# EAGLE board OmnibusB (EAGLE 6.6.0), part 1 of 2
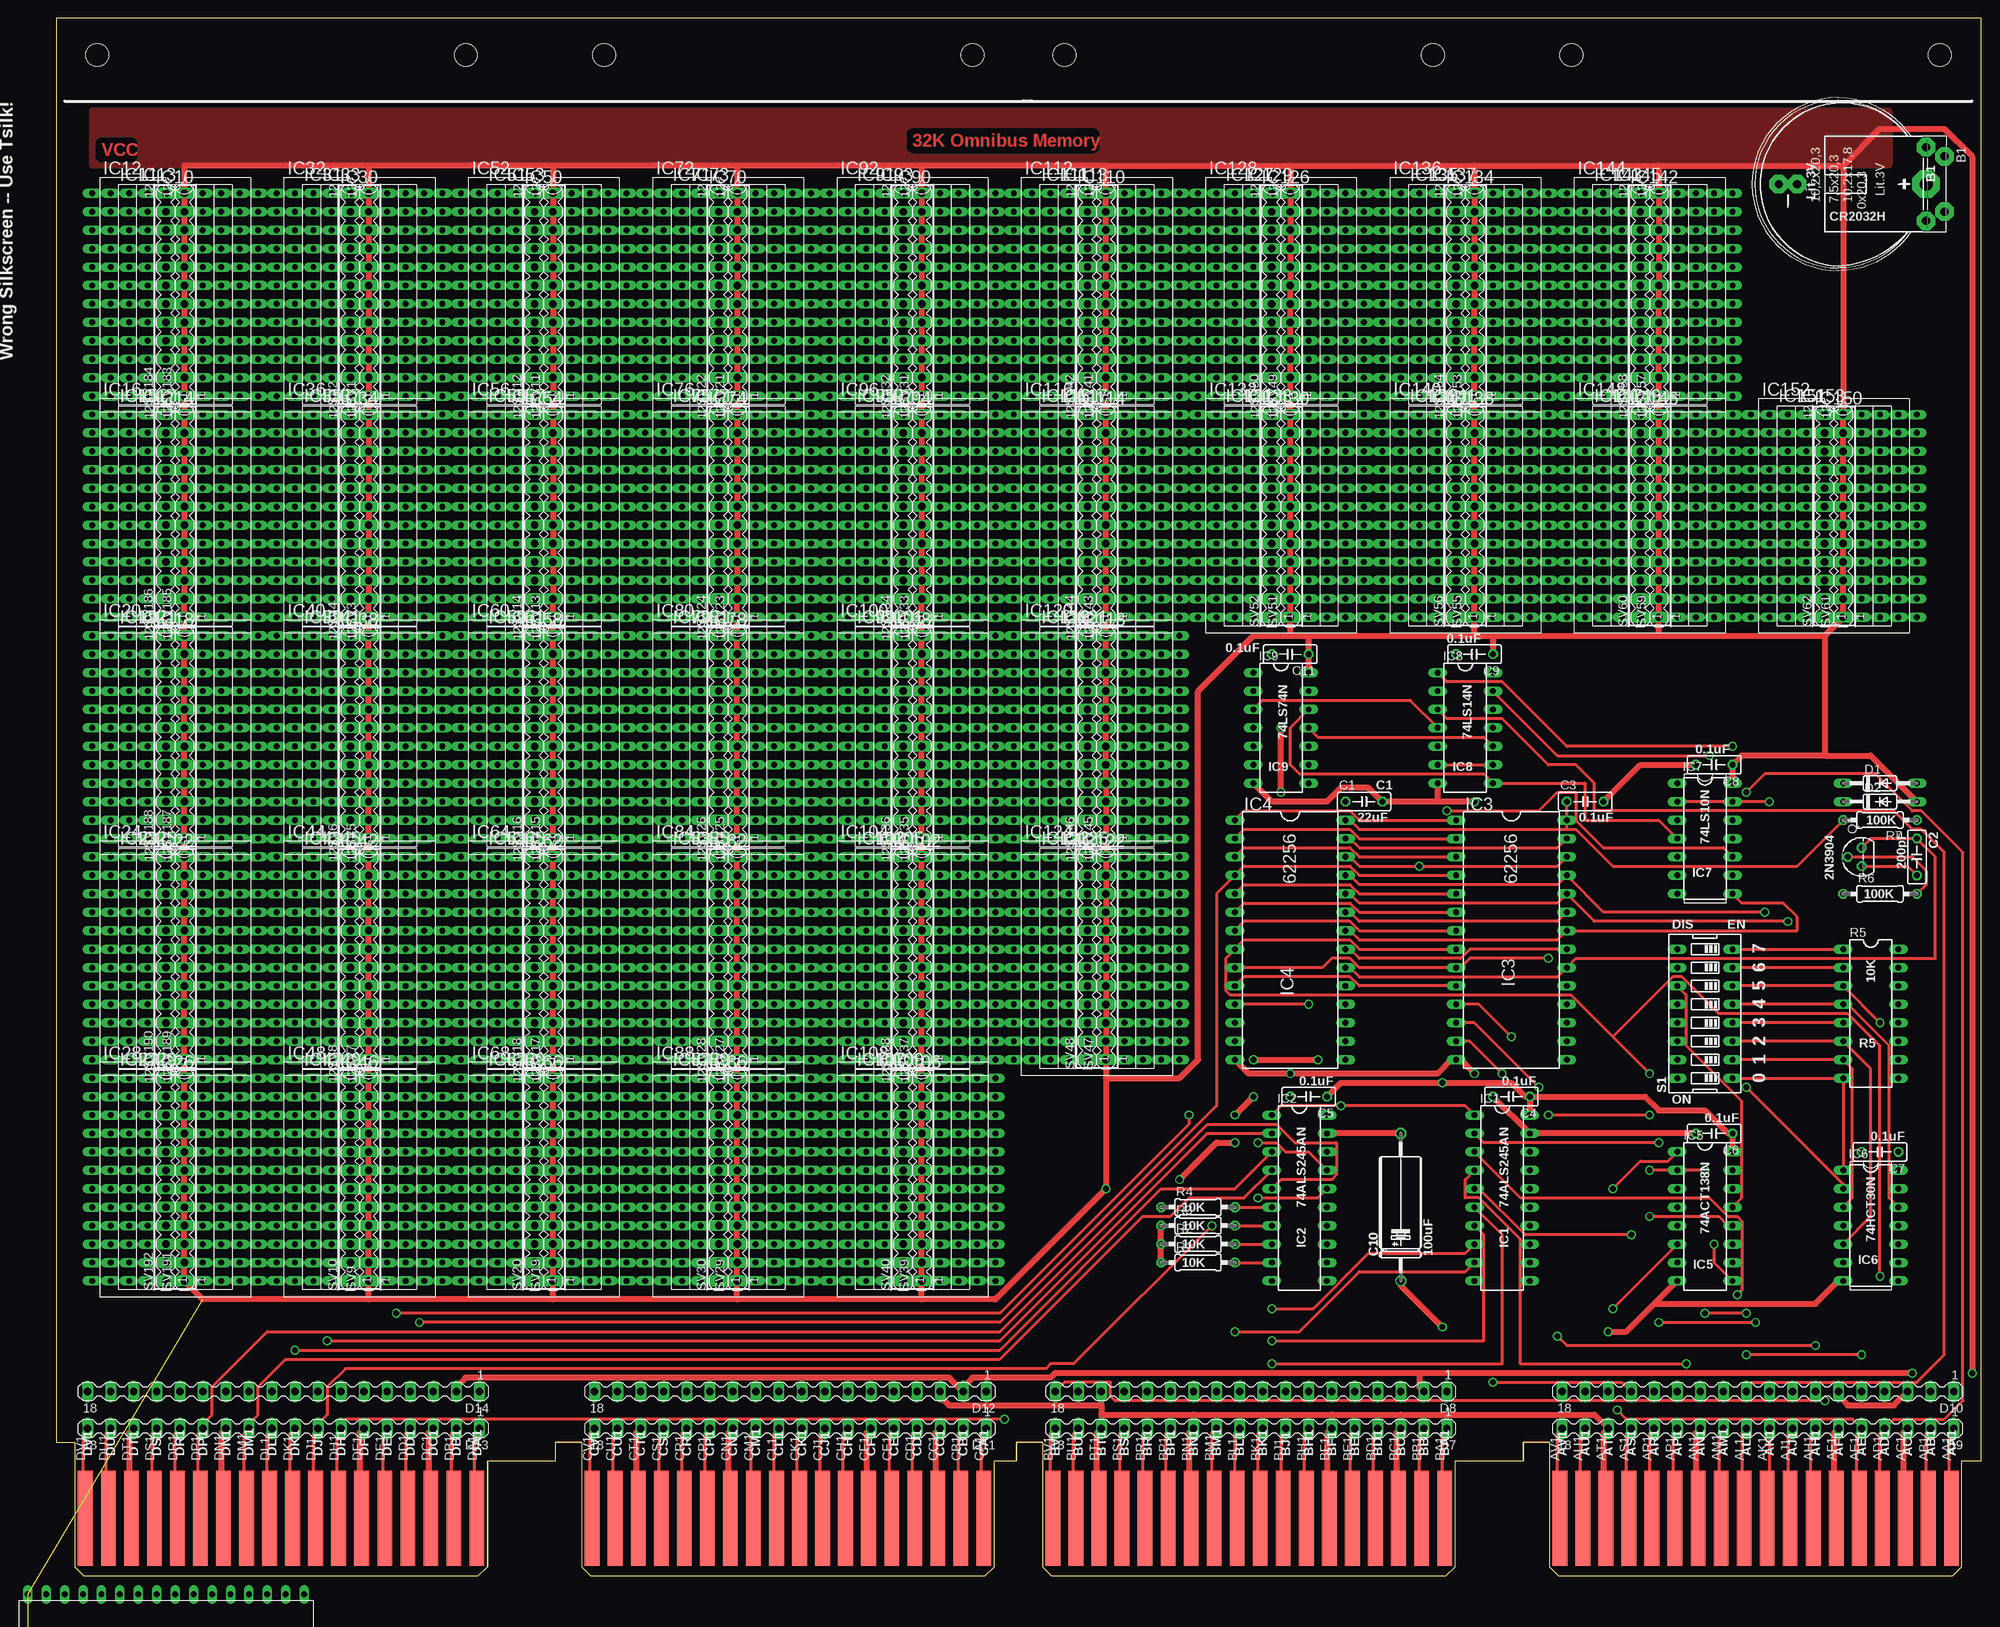
[diagram p4: board, top side]
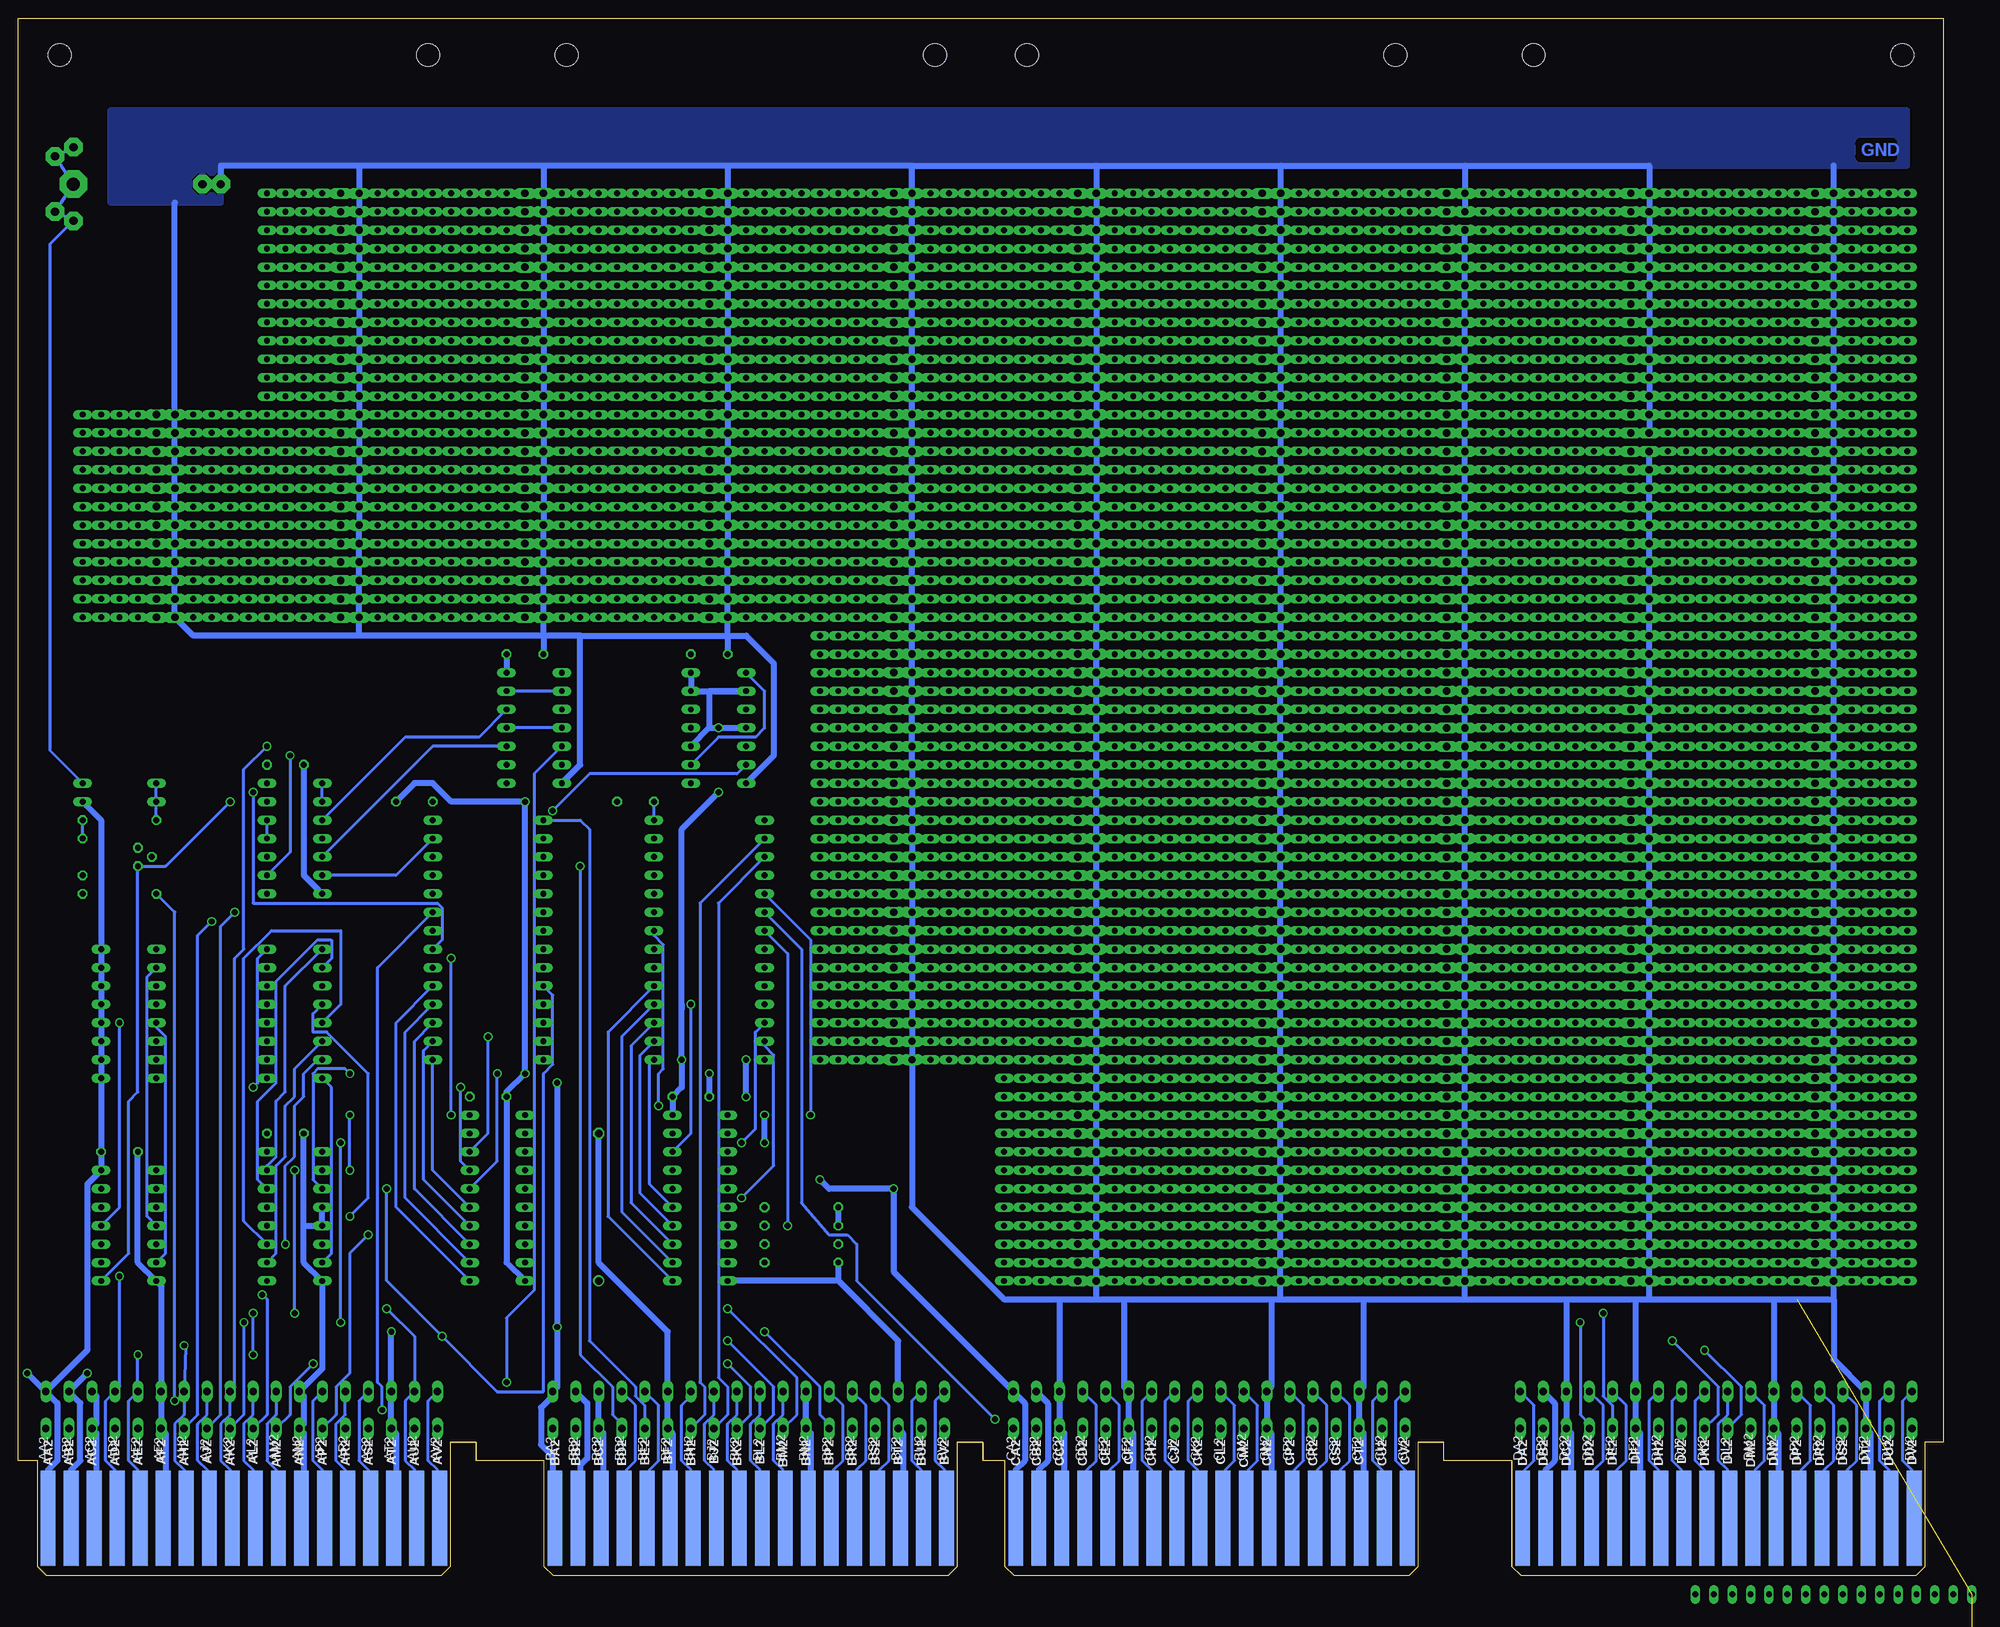
[diagram p5: board, bottom side, seen from below]

Size 265.3 x 214.63 mm. Coordinates in mm from the lower left corner, seen from the top.
Copper layers (1+16): Top 0.035mm / dielectric 1.5mm / Bottom 0.035mm
Design rules "16mils": minimum track width 16mil, minimum drill 32mil, track to track 15mil, track to pad 10mil, pad to pad 10mil, via to via 10mil, smd to smd 10mil, copper to edge 13mil, drill to drill 10mil, minimum pad ring 10mil, minimum via ring 8mil, stop-mask expansion 0mil, vias tented up to drill 0mil, thermal gap 10mil
Net classes: 1 supply: width 0.813 mm

## Footprints (pad centres in the part's own frame; a part is rotated, then mirrored left to right if it is on the bottom)
B2430UNI = drill 1.118 pad 2.54 octagon: + 3.81,14.605; +@1 -3.81,14.605; +@2 -5.08,12.065; +@3 5.08,12.065; - 0,-5.715; -@1 0,-8.255 | drill 1.803 pad 3.81 octagon: +@4 0,12.065
C050-025X075 = drill 0.813 octagon: 1 -2.54,0; 2 2.54,0
E12-8 = drill 1.016: + -10.16,0 | drill 1.016 octagon: - 10.16,0
DO35-10 = drill 0.813 long: A 5.08,0; C -5.08,0
MA18-1 = drill 1.016 long: 1 -25.4,0; 2 -22.225,0; 3 -19.05,0; 4 -15.875,0; 5 -12.7,0; 6 -9.525,0; 7 -6.35,0; 8 -3.175,0; 9 0,0; 10 3.175,0; 11 6.35,0; 12 9.525,0; 13 12.7,0; 14 15.875,0; 15 19.05,0; 16 22.225,0; 17 25.4,0; 18 28.575,0
DIL20 = drill 0.813 long: 1 -11.43,-3.81; 2 -8.89,-3.81; 3 -6.35,-3.81; 4 -3.81,-3.81; 5 -1.27,-3.81; 6 1.27,-3.81; 7 3.81,-3.81; 8 6.35,-3.81; 9 8.89,-3.81; 10 11.43,-3.81; 11 11.43,3.81; 12 8.89,3.81; 13 6.35,3.81; 14 3.81,3.81; 15 1.27,3.81; 16 -1.27,3.81; 17 -3.81,3.81; 18 -6.35,3.81; 19 -8.89,3.81; 20 -11.43,3.81
DIL28-6 = drill 0.813 long: 1 -16.51,-7.62; 2 -13.97,-7.62; 3 -11.43,-7.62; 4 -8.89,-7.62; 5 -6.35,-7.62; 6 -3.81,-7.62; 7 -1.27,-7.62; 8 1.27,-7.62; 9 3.81,-7.62; 10 6.35,-7.62; 11 8.89,-7.62; 12 11.43,-7.62; 13 13.97,-7.62; 14 16.51,-7.62; 15 16.51,7.62; 16 13.97,7.62; 17 11.43,7.62; 18 8.89,7.62; 19 6.35,7.62; 20 3.81,7.62; 21 1.27,7.62; 22 -1.27,7.62; 23 -3.81,7.62; 24 -6.35,7.62; 25 -8.89,7.62; 26 -11.43,7.62; 27 -13.97,7.62; 28 -16.51,7.62
DIL16 = drill 0.813 long: 1 -8.89,-3.81; 2 -6.35,-3.81; 3 -3.81,-3.81; 4 -1.27,-3.81; 5 1.27,-3.81; 6 3.81,-3.81; 7 6.35,-3.81; 8 8.89,-3.81; 9 8.89,3.81; 10 6.35,3.81; 11 3.81,3.81; 12 1.27,3.81; 13 -1.27,3.81; 14 -3.81,3.81; 15 -6.35,3.81; 16 -8.89,3.81
DIL14 = drill 0.813 long: 1 -7.62,-3.81; 2 -5.08,-3.81; 3 -2.54,-3.81; 4 0,-3.81; 5 2.54,-3.81; 6 5.08,-3.81; 7 7.62,-3.81; 8 7.62,3.81; 9 5.08,3.81; 10 2.54,3.81; 11 0,3.81; 12 -2.54,3.81; 13 -5.08,3.81; 14 -7.62,3.81
DIL24-3 = drill 0.813 long: 1 -13.97,-3.81; 2 -11.43,-3.81; 3 -8.89,-3.81; 4 -6.35,-3.81; 5 -3.81,-3.81; 6 -1.27,-3.81; 7 1.27,-3.81; 8 3.81,-3.81; 9 6.35,-3.81; 10 8.89,-3.81; 11 11.43,-3.81; 12 13.97,-3.81; 13 13.97,3.81; 14 11.43,3.81; 15 8.89,3.81; 16 6.35,3.81; 17 3.81,3.81; 18 1.27,3.81; 19 -1.27,3.81; 20 -3.81,3.81; 21 -6.35,3.81; 22 -8.89,3.81; 23 -11.43,3.81; 24 -13.97,3.81
DIL24-6 = drill 0.813 long: 1 -13.97,-7.62; 2 -11.43,-7.62; 3 -8.89,-7.62; 4 -6.35,-7.62; 5 -3.81,-7.62; 6 -1.27,-7.62; 7 1.27,-7.62; 8 3.81,-7.62; 9 6.35,-7.62; 10 8.89,-7.62; 11 11.43,-7.62; 12 13.97,-7.62; 13 13.97,7.62; 14 11.43,7.62; 15 8.89,7.62; 16 6.35,7.62; 17 3.81,7.62; 18 1.27,7.62; 19 -1.27,7.62; 20 -3.81,7.62; 21 -6.35,7.62; 22 -8.89,7.62; 23 -11.43,7.62; 24 -13.97,7.62
DIL24-9 = drill 0.813 long: 1 -13.97,-11.43; 2 -11.43,-11.43; 3 -8.89,-11.43; 4 -6.35,-11.43; 5 -3.81,-11.43; 6 -1.27,-11.43; 7 1.27,-11.43; 8 3.81,-11.43; 9 6.35,-11.43; 10 8.89,-11.43; 11 11.43,-11.43; 12 13.97,-11.43; 13 13.97,11.43; 14 11.43,11.43; 15 8.89,11.43; 16 6.35,11.43; 17 3.81,11.43; 18 1.27,11.43; 19 -1.27,11.43; 20 -3.81,11.43; 21 -6.35,11.43; 22 -8.89,11.43; 23 -11.43,11.43; 24 -13.97,11.43
DIL32 = drill 0.813 long: 1 -19.05,-7.62; 2 -16.51,-7.62; 3 -13.97,-7.62; 4 -11.43,-7.62; 5 -8.89,-7.62; 6 -6.35,-7.62; 7 -3.81,-7.62; 8 -1.27,-7.62; 9 1.27,-7.62; 10 3.81,-7.62; 11 6.35,-7.62; 12 8.89,-7.62; 13 11.43,-7.62; 14 13.97,-7.62; 15 16.51,-7.62; 16 19.05,-7.62; 17 19.05,7.62; 18 16.51,7.62; 19 13.97,7.62; 20 11.43,7.62; 21 8.89,7.62; 22 6.35,7.62; 23 3.81,7.62; 24 1.27,7.62; 25 -1.27,7.62; 26 -3.81,7.62; 27 -6.35,7.62; 28 -8.89,7.62; 29 -11.43,7.62; 30 -13.97,7.62; 31 -16.51,7.62; 32 -19.05,7.62
TO92 = drill 0.813 octagon: 1 1.27,0; 2 0,1.905; 3 -1.27,0
0207/10 = drill 0.813 octagon: 1 -5.08,0; 2 5.08,0
EDG-08 = drill 0.813 long: 1 -8.89,-3.81; 2 -6.35,-3.81; 3 -3.81,-3.81; 4 -1.27,-3.81; 5 1.27,-3.81; 6 3.81,-3.81; 7 6.35,-3.81; 8 8.89,-3.81; 9 8.89,3.81; 10 6.35,3.81; 11 3.81,3.81; 12 1.27,3.81; 13 -1.27,3.81; 14 -3.81,3.81; 15 -6.35,3.81; 16 -8.89,3.81
MA12-1 = drill 1.016 long: 1 -13.97,0; 2 -11.43,0; 3 -8.89,0; 4 -6.35,0; 5 -3.81,0; 6 -1.27,0; 7 1.27,0; 8 3.81,0; 9 6.35,0; 10 8.89,0; 11 11.43,0; 12 13.97,0
OMNIBUS = hole 3.175: 208.915,209.55; 259.715,209.55; 189.865,209.55; 139.065,209.55; 75.616,209.55; 126.416,209.55; 56.566,209.55; 5.766,209.55
EDGE-CON8 = smd 2.032 x 13.106: AA1 261.303,7.938; AB1 258.127,7.938; AC1 254.952,7.938; AD1 251.778,7.938; AE1 248.602,7.938; AF1 245.428,7.938; AH1 242.252,7.938; AJ1 239.077,7.938; AK1 235.903,7.938; AL1 232.727,7.938; AM1 229.553,7.938; AN1 226.377,7.938; AP1 223.202,7.938; AR1 220.028,7.938; AS1 216.852,7.938; AT1 213.678,7.938; AU1 210.502,7.938; AV1 207.327,7.938; BA1 191.452,7.938; BB1 188.278,7.938; BC1 185.102,7.938; BD1 181.928,7.938; BE1 178.752,7.938; BF1 175.577,7.938; BH1 172.403,7.938; BJ1 169.227,7.938; BK1 166.053,7.938; BL1 162.877,7.938; BM1 159.702,7.938; BN1 156.528,7.938; BP1 153.352,7.938; BR1 150.178,7.938; BS1 147.002,7.938; BT1 143.827,7.938; BU1 140.653,7.938; BV1 137.477,7.938; CA1 127.953,7.938; CB1 124.778,7.938; CC1 121.603,7.938; CD1 118.427,7.938; CE1 115.252,7.938; CF1 112.078,7.938; CH1 108.903,7.938; CJ1 105.728,7.938; CK1 102.552,7.938; CL1 99.377,7.938; CM1 96.203,7.938; CN1 93.028,7.938; CP1 89.853,7.938; CR1 86.677,7.938; CS1 83.502,7.938; CT1 80.328,7.938; CU1 77.153,7.938; CV1 73.978,7.938; DA1 58.102,7.938; DB1 54.928,7.938; DC1 51.752,7.938; DD1 48.578,7.938; DE1 45.403,7.938; DF1 42.227,7.938; DH1 39.053,7.938; DJ1 35.877,7.938; DK1 32.703,7.938; DL1 29.527,7.938; DM1 26.352,7.938; DN1 23.177,7.938; DP1 20.003,7.938; DR1 16.828,7.938; DS1 13.652,7.938; DT1 10.477,7.938; DU1 7.303,7.938; DV1 4.128,7.938 | smd 2.032 x 13.106 bottom: AA2 261.303,7.938; AB2 258.127,7.938; AC2 254.952,7.938; AD2 251.778,7.938; AE2 248.602,7.938; AF2 245.428,7.938; AH2 242.252,7.938; AJ2 239.077,7.938; AK2 235.903,7.938; AL2 232.727,7.938; AM2 229.553,7.938; AN2 226.377,7.938; AP2 223.202,7.938; AR2 220.028,7.938; AS2 216.852,7.938; AT2 213.678,7.938; AU2 210.502,7.938; AV2 207.327,7.938; BA2 191.452,7.938; BB2 188.278,7.938; BC2 185.102,7.938; BD2 181.928,7.938; BE2 178.752,7.938; BF2 175.577,7.938; BH2 172.403,7.938; BJ2 169.227,7.938; BK2 166.053,7.938; BL2 162.877,7.938; BM2 159.702,7.938; BN2 156.528,7.938; BP2 153.352,7.938; BR2 150.178,7.938; BS2 147.002,7.938; BT2 143.827,7.938; BU2 140.653,7.938; BV2 137.477,7.938; CA2 127.953,7.938; CB2 124.778,7.938; CC2 121.603,7.938; CD2 118.427,7.938; CE2 115.252,7.938; CF2 112.078,7.938; CH2 108.903,7.938; CJ2 105.728,7.938; CK2 102.552,7.938; CL2 99.377,7.938; CM2 96.203,7.938; CN2 93.028,7.938; CP2 89.853,7.938; CR2 86.677,7.938; CS2 83.502,7.938; CT2 80.328,7.938; CU2 77.153,7.938; CV2 73.978,7.938; DA2 58.102,7.938; DB2 54.928,7.938; DC2 51.752,7.938; DD2 48.578,7.938; DE2 45.403,7.938; DF2 42.227,7.938; DH2 39.053,7.938; DJ2 35.877,7.938; DK2 32.703,7.938; DL2 29.527,7.938; DM2 26.352,7.938; DN2 23.177,7.938; DP2 20.003,7.938; DR2 16.828,7.938; DS2 13.652,7.938; DT2 10.477,7.938; DU2 7.303,7.938; DV2 4.128,7.938

## Placement (x,y rotation side)
B1  CR2032  [B2430UNI]  245.62,191.77 270 top
C1  22uF  [C050-025X075]  180.21,106.68 0 top
C2  200pF  [C050-025X075]  256.41,99.06 270 top
C3  0.1uF  [C050-025X075]  210.69,106.68 0 top
C4  0.1uF  [C050-025X075]  200.53,66.04 180 top
C5  0.1uF  [C050-025X075]  172.59,66.04 180 top
C6  0.1uF  [C050-025X075]  228.47,60.96 180 top
C7  0.1uF  [C050-025X075]  251.33,58.42 180 top
C8  0.1uF  [C050-025X075]  228.47,111.76 180 top
C9  0.1uF  [C050-025X075]  195.45,127 180 top
C10  100uF  [E12-8]  185.29,50.8 90 top
C11  0.1uF  [C050-025X075]  170.05,127 180 top
D1  [DO35-10]  251.33,109.22 0 top
D2  [DO35-10]  251.33,106.68 0 top
D7  MA18-1  [MA18-1]  166.24,20.32 180 top
D8  MA18-1  [MA18-1]  166.24,25.4 180 top
D9  MA18-1  [MA18-1]  236.09,20.32 180 top
D10  MA18-1  [MA18-1]  236.09,25.4 180 top
D11  MA18-1  [MA18-1]  102.74,20.32 180 top
D12  MA18-1  [MA18-1]  102.74,25.4 180 top
D13  MA18-1  [MA18-1]  32.89,20.32 180 top
D14  MA18-1  [MA18-1]  32.89,25.4 180 top
IC1  74ALS245AN  [DIL20]  199.26,52.07 270 top
IC2  74ALS245AN  [DIL20]  171.32,52.07 270 top
IC3  62256  [DIL28-6]  200.53,87.63 270 top
IC4  62256  [DIL28-6]  170.05,87.63 270 top
IC5  74ACT138N  [DIL16]  227.2,49.53 270 top
IC6  74HCT30N  [DIL14]  250.06,48.26 270 top
IC7  74LS10N  [DIL14]  227.2,101.6 270 top
IC8  74LS14N  [DIL14]  194.18,116.84 270 top
IC9  74LS74N  [DIL14]  168.78,116.84 270 top
IC10  [DIL24-3]  16.38,176.53 270 top
IC11  [DIL24-6]  15.11,176.53 270 top
IC12  [DIL24-9]  16.38,176.53 270 top
IC13  [DIL24-6]  17.65,176.53 270 top
IC14  [DIL24-3]  16.38,146.05 270 top
IC15  [DIL24-6]  15.11,146.05 270 top
IC16  [DIL24-9]  16.38,146.05 270 top
IC17  [DIL24-6]  17.65,146.05 270 top
IC18  [DIL24-3]  16.38,115.57 270 top
IC19  [DIL24-6]  15.11,115.57 270 top
IC20  [DIL24-9]  16.38,115.57 270 top
IC21  [DIL24-6]  17.65,115.57 270 top
IC22  [DIL24-3]  16.38,85.09 270 top
IC23  [DIL24-6]  15.11,85.09 270 top
IC24  [DIL24-9]  16.38,85.09 270 top
IC25  [DIL24-6]  17.65,85.09 270 top
IC26  [DIL24-3]  16.38,54.61 270 top
IC27  [DIL24-6]  15.11,54.61 270 top
IC28  [DIL24-9]  16.38,54.61 270 top
IC29  [DIL24-6]  17.65,54.61 270 top
IC30  [DIL24-3]  41.78,176.53 270 top
IC31  [DIL24-6]  40.51,176.53 270 top
IC32  [DIL24-9]  41.78,176.53 270 top
IC33  [DIL24-6]  43.05,176.53 270 top
IC34  [DIL24-3]  41.78,146.05 270 top
IC35  [DIL24-6]  40.51,146.05 270 top
IC36  [DIL24-9]  41.78,146.05 270 top
IC37  [DIL24-6]  43.05,146.05 270 top
IC38  [DIL24-3]  41.78,115.57 270 top
IC39  [DIL24-6]  40.51,115.57 270 top
IC40  [DIL24-9]  41.78,115.57 270 top
IC41  [DIL24-6]  43.05,115.57 270 top
IC42  [DIL24-3]  41.78,85.09 270 top
IC43  [DIL24-6]  40.51,85.09 270 top
IC44  [DIL24-9]  41.78,85.09 270 top
IC45  [DIL24-6]  43.05,85.09 270 top
IC46  [DIL24-3]  41.78,54.61 270 top
IC47  [DIL24-6]  40.51,54.61 270 top
IC48  [DIL24-9]  41.78,54.61 270 top
IC49  [DIL24-6]  43.05,54.61 270 top
IC50  [DIL24-3]  67.18,176.53 270 top
IC51  [DIL24-6]  65.91,176.53 270 top
IC52  [DIL24-9]  67.18,176.53 270 top
IC53  [DIL24-6]  68.45,176.53 270 top
IC54  [DIL24-3]  67.18,146.05 270 top
IC55  [DIL24-6]  65.91,146.05 270 top
IC56  [DIL24-9]  67.18,146.05 270 top
IC57  [DIL24-6]  68.45,146.05 270 top
IC58  [DIL24-3]  67.18,115.57 270 top
IC59  [DIL24-6]  65.91,115.57 270 top
IC60  [DIL24-9]  67.18,115.57 270 top
IC61  [DIL24-6]  68.45,115.57 270 top
IC62  [DIL24-3]  67.18,85.09 270 top
IC63  [DIL24-6]  65.91,85.09 270 top
IC64  [DIL24-9]  67.18,85.09 270 top
IC65  [DIL24-6]  68.45,85.09 270 top
IC66  [DIL24-3]  67.18,54.61 270 top
IC67  [DIL24-6]  65.91,54.61 270 top
IC68  [DIL24-9]  67.18,54.61 270 top
IC69  [DIL24-6]  68.45,54.61 270 top
IC70  [DIL24-3]  92.58,176.53 270 top
IC71  [DIL24-6]  91.31,176.53 270 top
IC72  [DIL24-9]  92.58,176.53 270 top
IC73  [DIL24-6]  93.85,176.53 270 top
IC74  [DIL24-3]  92.58,146.05 270 top
IC75  [DIL24-6]  91.31,146.05 270 top
IC76  [DIL24-9]  92.58,146.05 270 top
IC77  [DIL24-6]  93.85,146.05 270 top
IC78  [DIL24-3]  92.58,115.57 270 top
IC79  [DIL24-6]  91.31,115.57 270 top
IC80  [DIL24-9]  92.58,115.57 270 top
IC81  [DIL24-6]  93.85,115.57 270 top
IC82  [DIL24-3]  92.58,85.09 270 top
IC83  [DIL24-6]  91.31,85.09 270 top
IC84  [DIL24-9]  92.58,85.09 270 top
IC85  [DIL24-6]  93.85,85.09 270 top
IC86  [DIL24-3]  92.58,54.61 270 top
IC87  [DIL24-6]  91.31,54.61 270 top
IC88  [DIL24-9]  92.58,54.61 270 top
IC89  [DIL24-6]  93.85,54.61 270 top
IC90  [DIL24-3]  117.98,176.53 270 top
IC91  [DIL24-6]  116.71,176.53 270 top
IC92  [DIL24-9]  117.98,176.53 270 top
IC93  [DIL24-6]  119.25,176.53 270 top
IC94  [DIL24-3]  117.98,146.05 270 top
IC95  [DIL24-6]  116.71,146.05 270 top
IC96  [DIL24-9]  117.98,146.05 270 top
IC97  [DIL24-6]  119.25,146.05 270 top
IC98  [DIL24-3]  117.98,115.57 270 top
IC99  [DIL24-6]  116.71,115.57 270 top
IC100  [DIL24-9]  117.98,115.57 270 top
IC101  [DIL24-6]  119.25,115.57 270 top
IC102  [DIL24-3]  117.98,85.09 270 top
IC103  [DIL24-6]  116.71,85.09 270 top
IC104  [DIL24-9]  117.98,85.09 270 top
IC105  [DIL24-6]  119.25,85.09 270 top
IC106  [DIL24-3]  117.98,54.61 270 top
IC107  [DIL24-6]  116.71,54.61 270 top
IC108  [DIL24-9]  117.98,54.61 270 top
IC109  [DIL24-6]  119.25,54.61 270 top
IC110  [DIL24-3]  143.38,176.53 270 top
IC111  [DIL24-6]  142.11,176.53 270 top
IC112  [DIL24-9]  143.38,176.53 270 top
IC113  [DIL24-6]  144.65,176.53 270 top
IC114  [DIL24-3]  143.38,146.05 270 top
IC115  [DIL24-6]  142.11,146.05 270 top
IC116  [DIL24-9]  143.38,146.05 270 top
IC117  [DIL24-6]  144.65,146.05 270 top
IC118  [DIL24-3]  143.38,115.57 270 top
IC119  [DIL24-6]  142.11,115.57 270 top
IC120  [DIL24-9]  143.38,115.57 270 top
IC121  [DIL24-6]  144.65,115.57 270 top
IC122  [DIL24-3]  143.38,85.09 270 top
IC123  [DIL24-6]  142.11,85.09 270 top
IC124  [DIL24-9]  143.38,85.09 270 top
IC125  [DIL24-6]  144.65,85.09 270 top
IC126  [DIL24-3]  168.78,176.53 270 top
IC127  [DIL24-6]  167.51,176.53 270 top
IC128  [DIL24-9]  168.78,176.53 270 top
IC129  [DIL24-6]  170.05,176.53 270 top
IC130  [DIL24-3]  168.78,146.05 270 top
IC131  [DIL24-6]  167.51,146.05 270 top
IC132  [DIL24-9]  168.78,146.05 270 top
IC133  [DIL24-6]  170.05,146.05 270 top
IC134  [DIL24-3]  194.18,176.53 270 top
IC135  [DIL24-6]  192.91,176.53 270 top
IC136  [DIL24-9]  194.18,176.53 270 top
IC137  [DIL24-6]  195.45,176.53 270 top
IC138  [DIL24-3]  194.18,146.05 270 top
IC139  [DIL24-6]  192.91,146.05 270 top
IC140  [DIL24-9]  194.18,146.05 270 top
IC141  [DIL24-6]  195.45,146.05 270 top
IC142  [DIL24-3]  219.58,176.53 270 top
IC143  [DIL24-6]  218.31,176.53 270 top
IC144  [DIL24-9]  219.58,176.53 270 top
IC145  [DIL24-6]  220.85,176.53 270 top
IC146  [DIL24-3]  219.58,146.05 270 top
IC147  [DIL24-6]  218.31,146.05 270 top
IC148  [DIL24-9]  219.58,146.05 270 top
IC149  [DIL24-6]  220.85,146.05 270 top
IC150  [DIL24-3]  244.98,146.05 270 top
IC151  [DIL24-6]  243.71,146.05 270 top
IC152  [DIL24-9]  244.98,146.05 270 top
IC153  [DIL24-6]  246.25,146.05 270 top
IC154  AS6C1008  [DIL32]  15.11,-10.16 0 top
IC155  AS6C1008  [DIL32]  15.11,-27.94 0 top  (outside the outline)
Q1  2N3904  [TO92]  248.79,99.06 90 top
R1  10K  [0207/10]  157.35,43.18 0 top
R2  10K  [0207/10]  157.35,45.72 0 top
R3  10K  [0207/10]  157.35,48.26 0 top
R4  10K  [0207/10]  157.35,50.8 0 top
R5  10K  [DIL16]  250.06,77.47 270 top
R6  100K  [0207/10]  251.33,93.98 0 top
R7  100K  [0207/10]  251.33,104.14 180 top
S1  [EDG-08]  227.2,77.47 90 top
SV1  [MA12-1]  43.05,176.53 90 top
SV2  [MA12-1]  40.51,176.53 90 top
SV3  [MA12-1]  43.05,146.05 90 top
SV4  [MA12-1]  40.51,146.05 90 top
SV5  [MA12-1]  43.05,115.57 90 top
SV6  [MA12-1]  40.51,115.57 90 top
SV7  [MA12-1]  43.05,85.09 90 top
SV8  [MA12-1]  40.51,85.09 90 top
SV9  [MA12-1]  43.05,54.61 90 top
SV10  [MA12-1]  40.51,54.61 90 top
SV11  [MA12-1]  68.45,176.53 90 top
SV12  [MA12-1]  65.91,176.53 90 top
SV13  [MA12-1]  68.45,146.05 90 top
SV14  [MA12-1]  65.91,146.05 90 top
SV15  [MA12-1]  68.45,115.57 90 top
SV16  [MA12-1]  65.91,115.57 90 top
SV17  [MA12-1]  68.45,85.09 90 top
SV18  [MA12-1]  65.91,85.09 90 top
SV19  [MA12-1]  68.45,54.61 90 top
SV20  [MA12-1]  65.91,54.61 90 top
SV21  [MA12-1]  93.85,176.53 90 top
SV22  [MA12-1]  91.31,176.53 90 top
SV23  [MA12-1]  93.85,146.05 90 top
SV24  [MA12-1]  91.31,146.05 90 top
SV25  [MA12-1]  93.85,115.57 90 top
SV26  [MA12-1]  91.31,115.57 90 top
SV27  [MA12-1]  93.85,85.09 90 top
SV28  [MA12-1]  91.31,85.09 90 top
SV29  [MA12-1]  93.85,54.61 90 top
SV30  [MA12-1]  91.31,54.61 90 top
SV31  [MA12-1]  119.25,176.53 90 top
SV32  [MA12-1]  116.71,176.53 90 top
SV33  [MA12-1]  119.25,146.05 90 top
SV34  [MA12-1]  116.71,146.05 90 top
SV35  [MA12-1]  119.25,115.57 90 top
SV36  [MA12-1]  116.71,115.57 90 top
SV37  [MA12-1]  119.25,85.09 90 top
SV38  [MA12-1]  116.71,85.09 90 top
SV39  [MA12-1]  119.25,54.61 90 top
SV40  [MA12-1]  116.71,54.61 90 top
SV41  [MA12-1]  144.65,176.53 90 top
SV42  [MA12-1]  142.11,176.53 90 top
SV43  [MA12-1]  144.65,146.05 90 top
SV44  [MA12-1]  142.11,146.05 90 top
SV45  [MA12-1]  144.65,115.57 90 top
SV46  [MA12-1]  142.11,115.57 90 top
SV47  [MA12-1]  144.65,85.09 90 top
SV48  [MA12-1]  142.11,85.09 90 top
SV49  [MA12-1]  170.05,176.53 90 top
SV50  [MA12-1]  167.51,176.53 90 top
SV51  [MA12-1]  170.05,146.05 90 top
SV52  [MA12-1]  167.51,146.05 90 top
SV53  [MA12-1]  195.45,176.53 90 top
SV54  [MA12-1]  192.91,176.53 90 top
SV55  [MA12-1]  195.45,146.05 90 top
SV56  [MA12-1]  192.91,146.05 90 top
SV57  [MA12-1]  220.85,176.53 90 top
SV58  [MA12-1]  218.31,176.53 90 top
SV59  [MA12-1]  220.85,146.05 90 top
SV60  [MA12-1]  218.31,146.05 90 top
SV61  [MA12-1]  246.25,146.05 90 top
SV62  [MA12-1]  243.71,146.05 90 top
SV183  [MA12-1]  17.65,176.53 90 top
SV184  [MA12-1]  15.11,176.53 90 top
SV185  [MA12-1]  17.65,146.05 90 top
SV186  [MA12-1]  15.11,146.05 90 top
SV187  [MA12-1]  17.65,115.57 90 top
SV188  [MA12-1]  15.11,115.57 90 top
SV189  [MA12-1]  17.65,85.09 90 top
SV190  [MA12-1]  15.11,85.09 90 top
SV191  [MA12-1]  17.65,54.61 90 top
SV192  [MA12-1]  15.11,54.61 90 top
U$1  OUTLINE-OMNIBUS  [OMNIBUS]  -0.13,0 0 top
U$2  [EDGE-CON8]  -0.13,0 0 top

## Tracks (layer width: path | path; a pad name or v marks a point on that pad's centre or on a via)
!BREAK_CYCLE
  Bottom 0.406: D8.10 163.07,22.23 164.34,20.95 164.34,15.88 163.07,14.61 U$2.BL2
!BRK_DATA_CONT
  Bottom 0.406: D8.9 166.24,22.23 167.51,20.95 167.51,15.88 166.24,14.61 U$2.BK2
!BRK_IN_PROG
  Bottom 0.406: D8.5 177.04,23.5 177.04,15.88 178.31,14.61 U$2.BE2
!BUS_STROBE
  Top 0.406: D11.9 102.11,19.68 102.11,13.97 U$2.CK1
!C0
  Top 0.406: D11.5 114.81,19.68 114.81,13.97 U$2.CE1
!C1
  Top 0.406: D11.7 108.46,19.68 108.46,13.97 U$2.CH1
!C2
  Top 0.406: D11.8 105.28,19.68 105.28,13.97 U$2.CJ1
!CE
  Top 0.406: Q1.1 250.06,101.6 C2.1 258.95,99.06 258.95,85.09 209.42,85.09 IC3.20 206.88,82.55 179.58,82.55 178.31,83.82 IC4.20
  Bottom 0.406: C2.1 R7.1
!CPMA_DISABLE
  Top 0.406: D11.17 76.71,19.68 76.71,13.97 U$2.CU1
!D
  Bottom 0.406: D14.9 34.16,24.13 34.16,15.88 32.89,14.61 U$2.DK2
!DATA0
  Top 0.406: D9.14 219.58,19.68 219.58,13.97 U$2.AR1
!DATA1
  Top 0.406: D9.15 216.41,19.68 216.41,13.97 U$2.AS1
!DATA2
  Top 0.406: D9.17 210.06,19.68 210.06,13.97 U$2.AU1
!DATA3
  Top 0.406: D9.18 206.88,19.68 206.88,13.97 U$2.AV1
!DATA4
  Top 0.406: D7.14 149.73,19.68 149.73,13.97 U$2.BR1
!DATA5
  Top 0.406: D7.15 146.56,19.68 146.56,13.97 U$2.BS1
!DATA6
  Top 0.406: D7.17 140.21,19.68 140.21,13.97 U$2.BU1
!DATA7
  Top 0.406: D7.18 137.03,19.68 137.03,13.97 U$2.BV1
!DATA8
  Top 0.406: D13.14 16.38,19.68 16.38,13.97 U$2.DR1
!DATA9
  Top 0.406: D13.15 13.21,19.68 13.21,13.97 U$2.DS1
!DATA10
  Top 0.406: D13.17 6.86,19.68 6.86,13.97 U$2.DU1
!DATA11
  Top 0.406: D13.18 3.68,19.68 3.68,13.97 U$2.DV1
!DISABLE
  Bottom 0.406: IC7.11 IC7.12
!E
  Bottom 0.406: D14.10 29.72,22.23 30.99,20.95 30.99,15.88 29.72,14.61 U$2.DL2
!EMA0  (via drill 0.81)
  Top 0.406: IC3.8 179.58,86.36 178.31,87.63 163.7,87.63 IC4.8 161.16,85.09 161.16,80.64 161.8,80.01 208.79,80.01 214.5,74.3 | 214.5,74.3 v219.58,69.22 | v251.33,41.27 251.33,73.03 246.89,77.47 229.11,77.47 224.03,82.55 222.76,82.55 214.5,74.3
  Bottom 0.406: U$2.AD2 251.97,14.61 253.24,15.88 253.24,24.13 D10.4 251.33,26.04 v251.33,41.27 | IC5.3 224.66,54.61 224.66,69.22 224.03,69.85 220.22,69.85 v219.58,69.22
!EMA1  (via drill 0.81)
  Top 0.406: IC4.9 174.5,83.82 175.77,85.09 178.31,85.09 179.58,83.82 IC3.9 193.55,83.82 194.82,85.09 v205.61,85.09 | v232.92,36.2 v227.2,36.2 | v248.79,30.48 v232.92,30.48 | v227.2,55.88 IC5.2 v219.58,55.88 | v219.58,63.5 v205.61,63.5
  Bottom 0.406: v227.2,36.2 v227.2,55.88 | v232.92,30.48 v232.92,36.2 | v248.79,30.48 D10.5 250.06,24.13 250.06,15.88 248.79,14.61 U$2.AE2 | v205.61,63.5 v205.61,85.09 | v219.58,55.88 v219.58,63.5
!EMA2  (via drill 0.81)
  Top 0.406: v242.44,31.75 208.15,31.75 v206.88,33.02 | IC4.10 163.7,82.55 178.31,82.55 179.58,81.28 IC3.10 | IC5.1 222.12,57.15 218.31,57.15 v214.5,53.34
  Bottom 0.406: U$2.AH2 242.44,14.61 243.71,15.88 243.71,20.95 242.44,22.23 D10.7 242.19,31.5 v242.44,31.75 | v214.5,53.34 214.5,40.64 v206.88,33.02 199.26,25.4 192.91,25.4 192.91,69.22 191.64,70.48 191.64,80.01 IC3.10
!F
  Bottom 0.406: D14.8 37.34,24.13 37.34,15.88 36.07,14.61 U$2.DJ2
!FSET
  Bottom 0.406: D14.13 18.29,23.5 18.29,15.88 19.56,14.61 U$2.DP2
!IND1
  Bottom 0.406: D12.17 78.61,24.13 78.61,15.88 77.34,14.61 U$2.CU2
!IND2
  Bottom 0.406: D12.18 75.44,24.13 75.44,15.88 74.17,14.61 U$2.CV2
!INT_RQST
  Top 0.406: D11.13 89.41,19.68 89.41,13.97 U$2.CP1
!INTERNAL_IO
  Top 0.406: D11.10 98.93,19.68 98.93,13.97 U$2.CL1
!IO_PAUSE
  Top 0.406: D11.4 117.98,19.68 117.98,13.97 U$2.CD1
!IR0
  Bottom 0.406: D14.4 46.86,23.5 46.86,15.88 48.13,14.61 U$2.DD2
!IR1
  Bottom 0.406: D14.5 43.69,23.5 43.69,15.88 44.96,14.61 U$2.DE2
!IR2
  Bottom 0.406: D14.7 40.51,24.13 40.51,15.88 39.24,14.61 U$2.DH2
!KEY_CONT
  Bottom 0.406: D14.17 8.76,24.13 8.76,15.88 7.49,14.61 U$2.DU2
!LA_ENABLE
  Bottom 0.406: D8.11 159.89,22.23 161.16,20.95 161.16,15.88 159.89,14.61 U$2.BM2
!LINK
  Bottom 0.406: D10.18 208.79,24.13 208.79,15.88 207.52,14.61 U$2.AV2
!LINK_DATA
  Bottom 0.406: D12.14 84.96,23.5 84.96,15.88 86.23,14.61 U$2.CR2
!LINK_LOAD
  Bottom 0.406: D12.15 81.79,23.5 81.79,15.88 83.06,14.61 U$2.CS2
!LOAD_CONT
  Bottom 0.406: D8.7 172.59,24.77 173.86,23.5 173.86,15.88 172.59,14.61 U$2.BH2
!MA00  (via drill 0.81)
  Top 0.406: IC4.21 178.31,86.36 179.58,85.09 193.55,85.09 194.82,86.36 IC3.21 | U$2.AD1 251.33,13.97 251.33,19.68 D9.4 253.24,21.59 260.22,21.59 262.76,24.13 262.76,99.69 257.05,105.41 255.78,105.41 250.7,110.49 235.46,110.49 v232.92,107.95
  Bottom 0.406: IC3.21 206.88,87.63 206.88,92.08 207.52,92.71 232.92,92.71 v232.92,107.95
!MA01  (via drill 0.81)
  Top 0.406: IC3.23 206.88,90.17 179.58,90.17 178.31,91.44 IC4.23 | U$2.AE1 248.16,13.97 248.16,19.68 D9.5 247.52,21.59 216.41,21.59 v215.14,22.86
  Bottom 0.406: IC3.23 215.77,83.82 215.77,26.67 215.14,26.04 v215.14,22.86
!MA02  (via drill 0.81)
  Top 0.406: IC4.24 178.31,93.98 179.58,92.71 206.88,92.71 IC3.24 211.96,90.17 v238.63,90.17 | D9.7 241.81,19.68 241.81,13.97 U$2.AH1
  Bottom 0.406: v238.63,90.17 240.54,88.27 240.54,22.23 D9.7
!MA03  (via drill 0.81)
  Top 0.406: IC4.25 178.31,96.52 179.58,95.25 206.88,95.25 IC3.25 213.23,91.44 v235.46,91.44 | D9.8 238.63,19.68 238.63,13.97 U$2.AJ1
  Bottom 0.406: v235.46,91.44 237.36,89.53 237.36,22.23 D9.8
!MA04  (via drill 0.81)
  Top 0.406: IC3.26 206.88,97.79 v187.83,97.79 179.58,97.79 178.31,99.06 IC4.26 | D7.4 181.48,19.68 181.48,13.97 U$2.BD1
  Bottom 0.406: v187.83,97.79 187.83,30.48 183.39,26.04 183.39,22.23 182.12,20.95 D7.4
!MA05
  Top 0.406: IC4.1 163.7,105.41 178.31,105.41 179.58,104.14 IC3.1 | D7.5 178.31,19.68 178.31,13.97 U$2.BE1
  Bottom 0.406: IC3.1 187.83,104.14 186.56,102.87 186.56,32.38 180.21,26.04 180.21,24.77 178.94,23.5 D7.5
!MA06
  Top 0.406: IC4.2 163.7,102.87 178.31,102.87 179.58,101.6 IC3.2 | D7.7 171.96,19.68 171.96,13.97 U$2.BH1
  Bottom 0.406: IC4.2 171.32,92.71 171.32,26.67 170.69,26.04 170.69,22.23 D7.7
!MA07
  Top 0.406: IC4.3 163.7,100.33 178.31,100.33 179.58,99.06 IC3.3 | D7.8 168.78,19.68 168.78,13.97 U$2.BJ1
  Bottom 0.406: IC4.3 168.78,92.71 168.78,27.3 167.51,26.04 167.51,22.23 D7.8
!MA08  (via drill 0.81)
  Top 0.406: IC3.4 179.58,96.52 178.31,97.79 163.7,97.79 IC4.4 159.89,93.98 159.89,64.77 130.05,34.92 v50.04,34.92 | D13.4 48.13,19.68 48.13,13.97 U$2.DD1
  Bottom 0.406: D13.4 48.51,20.7 50.04,22.23 v50.04,34.92
!MA09  (via drill 0.81)
  Top 0.406: IC4.5 163.7,95.25 178.31,95.25 179.58,93.98 IC3.5 | D13.5 44.96,19.68 44.96,13.97 U$2.DE1 | v156.08,63.5 156.08,62.23 130.05,36.2 v46.86,36.2
  Bottom 0.406: IC4.5 156.08,87.63 v156.08,63.5 | v46.86,36.2 46.86,24.77 45.59,23.5 D13.5
!MA10  (via drill 0.81)
  Top 0.406: IC4.6 163.7,92.71 178.31,92.71 179.58,91.44 IC3.6 | U$2.DH1 38.61,13.97 38.61,19.68 D13.7 39.24,20.95 39.88,21.59 v130.68,21.59
  Bottom 0.406: v130.68,21.59 149.73,40.64 149.73,45.72 151,46.99 153.54,46.99 157.35,51.44 157.35,86.36 IC4.6
!MA11  (via drill 0.81)
  Top 0.406: IC4.7 163.7,90.17 178.31,90.17 179.58,88.9 IC3.7 | U$2.DJ1 35.43,13.97 35.43,19.68 D13.8 36.07,20.95 37.34,22.23 37.34,26.04 39.88,28.57 136.4,28.57 137.03,29.21 140.21,29.21 v159.26,48.26
  Bottom 0.406: IC4.7 159.26,85.72 v159.26,48.26
!MD00  (via drill 0.81)
  Top 0.406: v220.85,59.69 196.72,59.69 IC1.2 | v220.85,34.92 v234.19,34.92 | U$2.AK1 236.09,13.97 D9.9
  Bottom 0.406: v220.85,34.92 v220.85,59.69 | v234.19,34.92 234.19,22.23 D9.9
!MD01  (via drill 0.81)
  Top 0.406: IC1.3 201.8,52.07 227.84,52.07 230.38,49.53 231.65,49.53 232.28,48.9 232.28,39.37 v231.65,38.73 | U$2.AL1 232.28,13.97 232.28,19.68 D9.10
  Bottom 0.406: v231.65,38.73 231.01,38.1 231.01,22.23 D9.10
!MD02  (via drill 0.81)
  Top 0.406: IC1.4 194.18,54.61 194.18,52.07 196.09,52.07 201.8,46.35 201.8,29.21 v224.66,29.21 | U$2.AM1 229.11,13.97 229.11,19.68 D9.11
  Bottom 0.406: v224.66,29.21 227.84,26.04 227.84,22.23 D9.11
!MD03  (via drill 0.81)
  Top 0.406: v217.04,46.99 202.44,46.99 196.09,53.34 IC1.5 | U$2.AP1 222.76,13.97 222.76,19.68 D9.13
  Bottom 0.406: v217.04,46.99 219.58,44.45 219.58,27.94 221.49,26.04 221.49,22.23 D9.13
!MD04  (via drill 0.81)
  Top 0.406: IC1.6 199.26,46.99 199.26,29.21 v167.51,29.21 | U$2.BK1 165.61,13.97 165.61,19.68 D7.9
  Bottom 0.406: v167.51,29.21 164.34,26.04 164.34,22.23 D7.9
!MD05  (via drill 0.81)
  Top 0.406: IC1.7 196.72,46.99 196.72,32.38 v167.51,32.38 | U$2.BL1 162.43,13.97 162.43,19.68 D7.10
  Bottom 0.406: v167.51,32.38 161.16,26.04 161.16,22.23 D7.10
!MD06  (via drill 0.81)
  Top 0.406: IC1.8 194.18,44.45 180.85,44.45 173.23,36.83 v167.51,36.83 | U$2.BM1 159.26,13.97 159.26,19.68 D7.11
  Bottom 0.406: v167.51,36.83 157.99,27.3 157.99,22.23 D7.11
!MD07  (via drill 0.81)
  Top 0.406: IC1.9 194.18,41.91 179.58,41.91 171.32,33.66 v162.43,33.66 | U$2.BP1 152.91,13.97 152.91,19.68 D7.13
  Bottom 0.406: v162.43,33.66 154.81,26.04 154.81,22.23 153.54,20.95 D7.13
!MD08  (via drill 0.81)
  Top 0.406: v37.34,32.38 130.05,32.38 158.62,60.96 IC2.2 | U$2.DK1 32.26,13.97 32.26,19.68 D13.9
  Bottom 0.406: v37.34,32.38 30.99,26.04 30.99,22.23 D13.9
!MD09  (via drill 0.81)
  Top 0.406: IC2.3 162.43,53.34 152.27,53.34 130.05,31.11 v32.89,31.11 | U$2.DL1 29.08,13.97 29.08,19.68 D13.10
  Bottom 0.406: v32.89,31.11 27.81,26.04 27.81,22.23 D13.10
!MD10
  Top 0.406: IC2.4 163.7,52.07 156.08,52.07 153.54,49.53 149.73,49.53 130.05,29.84 31.62,29.84 27.81,26.04 27.81,22.23 26.54,20.95 D13.11 25.91,19.68 25.91,13.97 U$2.DM1
!MD11
  Top 0.406: IC2.5 168.78,54.61 175.77,54.61 176.4,55.24 176.4,59.69 170.69,59.69 168.15,62.23 158.62,62.23 130.05,33.66 29.08,33.66 21.46,26.04 21.46,22.23 20.19,20.95 D13.13 19.56,19.68 19.56,13.97 U$2.DP1
!MD_DIR  (via drill 0.81)
  Top 0.406: IC8.1 191.64,123.19 199.26,123.19 208.15,114.3 v231.01,114.3
  Bottom 0.406: v231.01,114.3 234.19,111.12 234.19,86.36 235.46,85.09 235.46,26.04 D10.9 236.09,22.23 237.36,20.95 237.36,15.88 236.09,14.61 U$2.AK2
!MEM_START
  Bottom 0.406: D10.8 239.27,22.23 240.54,20.95 240.54,15.88 239.27,14.61 U$2.AJ2
!MS_DISABLE
  Top 0.406: D11.18 73.53,19.68 73.53,13.97 U$2.CV1
!NOT_LAST_TR
  Top 0.406: D11.11 95.76,19.68 95.76,13.97 U$2.CM1
!NTS_STALL
  Bottom 0.406: D8.14 148.46,23.5 148.46,15.88 149.73,14.61 U$2.BR2
!OVERFLOW
  Bottom 0.406: D8.8 169.42,22.23 170.69,20.95 170.69,15.88 169.42,14.61 U$2.BJ2
!READ_EN  (via drill 0.81)
  Top 0.406: IC2.1 168.78,64.77 v177.04,64.77 194.18,64.77 IC1.1 | IC4.22 178.31,88.9 179.58,87.63 206.88,87.63 IC3.22 239.9,88.9 239.9,90.81 238,92.71 232.28,92.71 IC7.8
  Bottom 0.406: v177.04,64.77 177.04,69.22 176.4,69.85 176.4,87 177.67,88.27 IC4.22
!ROM_ADDR  (via drill 0.81)
  Top 0.406: IC5.6 v214.5,36.83
  Bottom 0.406: v214.5,36.83 210.69,33.02 D10.17 211.96,24.13 211.96,15.88 210.69,14.61 U$2.AU2
!RUN
  Bottom 0.406: D8.17 142.11,24.13 142.11,15.88 140.84,14.61 U$2.BU2
!SKIP
  Top 0.406: D11.15 83.06,19.68 83.06,13.97 U$2.CS1
!STOP
  Bottom 0.406: D14.15 11.94,23.5 11.94,15.88 13.21,14.61 U$2.DS2
!TS1
  Bottom 0.406: D12.9 104.01,24.13 104.01,15.88 102.74,14.61 U$2.CK2
!TS2
  Bottom 0.406: D12.10 97.66,23.5 97.66,15.88 98.93,14.61 U$2.CL2
!TS3
  Bottom 0.406: D12.11 94.49,23.5 94.49,15.88 95.76,14.61 U$2.CM2
!TS4
  Bottom 0.406: D12.13 88.14,23.5 88.14,15.88 89.41,14.61 U$2.CP2
!USER_MODE
  Bottom 0.406: D14.11 24.64,23.5 24.64,15.88 25.91,14.61 U$2.DM2
!WRITE_EN
  Top 0.406: IC3.27 206.88,100.33 179.58,100.33 178.31,101.6 IC4.27
  Bottom 0.406: IC3.27 213.23,96.52 IC7.6
+15V
  Bottom 0.406: D14.1 56.39,23.5 56.39,15.88 57.66,14.61 U$2.DA2
-15V  (via drill 0.81)
  Top 0.813: D14.2 55.12,26.04 56.39,27.3 123.06,27.3 D12.2 124.97,26.04 126.24,27.3 137.03,27.3 137.67,27.94 187.83,27.94 | 187.83,27.94 187.83,26.04 D8.2 | v255.78,27.94 187.83,27.94
  Bottom 0.813: U$2.AB2 258,14.61 256.73,15.88 256.73,23.81 D10.2 v255.78,27.94 | D8.2 186.88,23.81 186.88,16.19 187.83,15.24 U$2.BB2 | D14.2 53.53,23.81 53.53,15.88 54.8,14.61 U$2.DB2 | D12.2 123.38,23.81 123.38,15.88 124.65,14.61 U$2.CB2
DISABLE  (via drill 0.81)
  Top 0.406: C2.2 255.14,97.79 Q1.3 | IC7.2 IC7.13 v236.09,106.68
  Bottom 0.406: IC6.8 250.06,44.45 250.06,65.41 248.79,66.67 Q1.3 244.98,97.79 v236.09,106.68 | IC7.2 IC7.1
EMEM0
  Bottom 0.406: IC4.19 184.02,74.93 184.02,49.53 IC2.11
EMEM1
  Bottom 0.406: IC2.12 182.12,50.16 182.12,74.3 IC4.18
EMEM2
  Bottom 0.406: IC2.13 180.85,51.44 180.85,73.03 IC4.17
EMEM3
  Bottom 0.406: IC2.14 179.58,52.7 179.58,71.75 IC4.16
GND  (via drill 0.81)
  Top 0.813: D11.12 92.58,19.68 92.58,13.97 U$2.CN2 | D13.6 41.78,19.68 41.78,13.97 U$2.DF2 | D13.3 51.31,19.68 51.31,13.97 U$2.DC2 | D11.16 79.88,19.68 79.88,13.97 U$2.CT2 | D9.3 254.51,19.68 254.51,13.97 U$2.AC1 | U$2.AF2 244.98,13.97 244.98,19.68 D9.6 | D10.3 253.24,23.5 246.89,23.5 245.62,24.77 D10.6 | U$2.AT2 213.23,13.97 213.23,19.68 D9.16 211.96,22.23 185.29,22.23 | U$2.BC1 184.66,13.97 184.66,19.68 D7.3 185.29,22.23 | D9.12 225.93,19.68 225.93,13.97 U$2.AN2 | IC4.14 164.34,69.22 v170.05,69.22 190.37,69.22 192.28,71.12 IC3.14 193.55,71.12 v195.45,69.22 | C4.2 IC1.19 C6.2 | 220.22,37.47 IC5.8 | 220.22,37.47 216.41,33.66 v213.87,33.66 | 220.22,37.47 242.44,37.47 245.62,40.64 IC6.7 | IC9.7 167.51,106.68 175.13,106.68 177.04,108.58 180.85,108.58 C1.2 190.37,106.68 | C10.- IC2.19 | U$2.BF2 175.13,13.97 175.13,19.68 D7.6 175.77,22.23 | U$2.BN2 156.08,13.97 156.08,19.68 D7.12 156.72,22.23 | R1.1 R2.1 R3.1 | 144.02,23.5 144.02,22.23 | 144.02,22.23 D7.16 143.38,19.68 143.38,13.97 U$2.BT2 | 144.02,23.5 D8.16 | 144.02,22.23 156.72,22.23 | 156.72,22.23 175.77,22.23 | D11.6 111.63,19.68 111.63,13.97 U$2.CF2 | D11.3 121.16,19.68 121.16,13.97 U$2.CC2 | D13.12 22.73,19.68 22.73,13.97 U$2.DN2 | D13.16 10.03,19.68 10.03,13.97 U$2.DT2 | C3.2 218.31,111.76 C8.2 | 144.02,23.5 123.06,23.5 121.79,24.77 D12.3 | v195.45,106.68 190.37,106.68 | 190.37,106.68 IC8.7 | 175.77,22.23 185.29,22.23
  Bottom 0.813: 92.58,38.1 92.58,26.04 D12.12 D11.12 92.58,19.68 92.58,13.97 U$2.CN2 | U$2.DF2 41.78,13.97 41.78,19.68 D13.6 D14.6 42.42,38.1 | U$2.DC2 51.31,13.97 51.31,19.68 D13.3 D14.3 51.94,38.1 | U$2.CT2 79.88,13.97 79.88,19.68 D11.16 D12.16 79.88,26.04 79.88,38.1 | D10.3 254.51,24.77 254.51,20.95 D9.3 254.51,19.68 254.51,13.97 U$2.AC1 | C7.2 248.79,43.18 IC6.7 245.62,40.01 D10.6 D9.6 244.98,19.68 244.98,13.97 U$2.AF2 | U$2.AT2 213.23,13.97 213.23,19.68 D9.16 D10.16 v213.87,33.66 | D8.3 D7.3 184.66,19.68 184.66,13.97 U$2.BC1 | U$2.AN2 225.93,13.97 225.93,19.68 D9.12 225.93,20.95 225.93,24.77 D10.12 223.39,28.57 IC5.8 225.93,43.18 225.93,48.26 | v170.05,69.22 C5.2 | IC1.10 197.99,43.18 C4.2 197.99,66.67 v195.45,69.22 v195.45,106.68 205.61,106.68 208.15,109.22 210.69,109.22 C3.2 | IC5.4 IC5.5 225.93,48.26 | 225.93,48.26 C6.2 | U$2.BF2 175.13,13.97 175.13,19.68 D7.6 D8.6 175.77,33.66 185.29,43.18 C10.- | D8.12 D7.12 156.08,19.68 156.08,13.97 U$2.BN2 | 152.27,40.64 IC2.10 | 152.27,40.64 R1.1 | R3.1 R4.1 | 152.27,40.64 144.02,32.38 D8.16 | U$2.BT2 143.38,13.97 143.38,19.68 D7.16 | U$2.CF2 111.63,13.97 111.63,19.68 D11.6 D12.6 112.9,26.04 112.9,38.1 | U$2.CC2 121.16,13.97 121.16,19.68 D11.3 D12.3 121.79,38.1 | U$2.DN2 22.73,13.97 22.73,19.68 D13.12 D14.12 23.37,38.1 | U$2.DT2 10.03,13.97 10.03,19.68 D13.16 D14.16 15.11,29.84 15.11,38.1 | IC7.7 225.93,96.52 C8.2 | 15.11,38.1 SV192.1 SV192.2 SV192.3 SV192.4 SV192.5 SV192.6 SV192.7 SV192.8 SV192.9 SV192.10 SV192.11 SV192.12 SV190.1 SV190.2 SV190.3 SV190.4 SV190.5 SV190.6 SV190.7 SV190.8 SV190.9 SV190.10 SV190.11 SV190.12 SV188.1 SV188.2 SV188.3 SV188.4 SV188.5 SV188.6 SV188.7 SV188.8 SV188.9 SV188.10 SV188.11 SV188.12 SV186.1 SV186.2 SV186.3 SV186.4 SV186.5 SV186.6 SV186.7 SV186.8 SV186.9 SV186.10 SV186.11 SV186.12 SV184.1 SV184.2 SV184.3 SV184.4 SV184.5 SV184.6 SV184.7 SV184.8 SV184.9 SV184.10 SV184.11 SV184.12 15.11,194.31
  Bottom 0.813: 112.9,38.1 92.58,38.1 | 40.51,38.1 SV10.1 SV10.2 SV10.3 SV10.4 SV10.5 SV10.6 SV10.7 SV10.8 SV10.9 SV10.10 SV10.11 SV10.12 SV8.1 SV8.2 SV8.3 SV8.4 SV8.5 SV8.6 SV8.7 SV8.8 SV8.9 SV8.10 SV8.11 SV8.12 SV6.1 SV6.2 SV6.3 SV6.4 SV6.5 SV6.6 SV6.7 SV6.8 SV6.9 SV6.10 SV6.11 SV6.12 SV4.1 SV4.2 SV4.3 SV4.4 SV4.5 SV4.6 SV4.7 SV4.8 SV4.9 SV4.10 | 42.42,38.1 40.51,38.1 | 40.51,38.1 23.37,38.1 | 23.37,38.1 15.11,38.1 | 51.94,38.1 42.42,38.1 | 65.91,38.1 51.94,38.1 | 79.88,38.1 65.91,38.1 | 91.31,38.1 79.88,38.1 | 92.58,38.1 91.31,38.1 | 116.71,38.1 112.9,38.1 | 121.79,38.1 116.71,38.1 | 65.91,194.31 40.51,194.31 SV2.12 SV2.11 SV2.10 SV2.9 SV2.8 SV2.7 SV2.6 SV2.5 SV2.4 SV2.3 SV2.2 SV2.1 SV4.12 SV4.11 | 121.79,38.1 129.41,38.1 142.11,50.8 SV48.1 SV48.2 SV48.3 SV48.4 SV48.5 SV48.6 SV48.7 SV48.8 SV48.9 SV48.10 SV48.11 SV48.12 SV46.1 SV46.2 SV46.3 SV46.4 SV46.5 SV46.6 SV46.7 SV46.8 SV46.9 SV46.10 SV46.11 SV46.12 SV44.1 SV44.2 SV44.3 SV44.4 SV44.5 SV44.6 SV44.7 SV44.8 SV44.9 SV44.10 SV44.11 SV44.12 SV42.1 SV42.2 SV42.3 SV42.4 SV42.5 SV42.6 SV42.7 SV42.8 SV42.9 SV42.10 SV42.11 SV42.12 142.11,194.31 | 91.31,194.31 65.91,194.31 | 167.51,129.54 C11.2 | 167.51,129.54 164.97,129.54 161.16,125.73 161.16,113.03 IC9.7 | IC8.7 187.83,111.76 187.83,129.54 | 192.91,129.54 C9.2 | 192.91,129.54 218.31,129.54 | 218.31,129.54 241.17,129.54 SV62.1 SV62.2 SV62.3 SV62.4 SV62.5 SV62.6 SV62.7 SV62.8 SV62.9 SV62.10 SV62.11 SV62.12 243.71,189.23 | 187.83,129.54 167.51,129.54 | 187.83,129.54 192.91,129.54 | SV12.10 SV12.9 SV12.8 SV12.7 SV12.6 SV12.5 SV12.4 SV12.3 SV12.2 SV12.1 SV14.12 SV14.11 SV14.10 SV14.9 SV14.8 SV14.7 SV14.6 SV14.5 SV14.4 SV14.3 SV14.2 SV14.1 SV16.12 SV16.11 SV16.10 SV16.9 SV16.8 SV16.7 SV16.6 SV16.5 SV16.4 SV16.3 SV16.2 SV16.1 SV18.12 SV18.11 SV18.10 SV18.9 SV18.8 SV18.7 SV18.6 SV18.5 SV18.4 SV18.3 SV18.2 SV18.1 SV20.12 SV20.11 SV20.10 SV20.9 SV20.8 SV20.7 SV20.6 SV20.5 SV20.4 SV20.3 SV20.2 SV20.1 65.91,38.1
  Bottom 0.813: SV12.11 SV12.12 65.91,194.31 | 91.31,38.1 SV30.1 SV30.2 SV30.3 SV30.4 SV30.5 SV30.6 SV30.7 SV30.8 SV30.9 SV30.10 SV30.11 SV30.12 SV28.1 SV28.2 SV28.3 SV28.4 SV28.5 SV28.6 SV28.7 SV28.8 SV28.9 SV28.10 SV28.11 SV28.12 SV26.1 SV26.2 SV26.3 SV26.4 SV26.5 SV26.6 SV26.7 SV26.8 SV26.9 SV26.10 SV26.11 SV26.12 SV24.1 SV24.2 SV24.3 SV24.4 SV24.5 SV24.6 SV24.7 SV24.8 SV24.9 SV24.10 SV24.11 SV24.12 SV22.1 SV22.2 SV22.3 SV22.4 SV22.5 SV22.6 SV22.7 SV22.8 SV22.9 SV22.10 SV22.11 SV22.12 91.31,194.31 | 116.71,38.1 SV40.1 SV40.2 SV40.3 SV40.4 SV40.5 SV40.6 SV40.7 SV40.8 SV40.9 SV40.10 SV40.11 SV40.12 SV38.1 SV38.2 SV38.3 SV38.4 SV38.5 SV38.6 SV38.7 SV38.8 SV38.9 SV38.10 SV38.11 SV38.12 SV36.1 SV36.2 SV36.3 SV36.4 SV36.5 SV36.6 SV36.7 SV36.8 SV36.9 SV36.10 SV36.11 SV36.12 SV34.1 SV34.2 SV34.3 SV34.4 SV34.5 SV34.6 SV34.7 SV34.8 SV34.9 SV34.10 SV34.11 SV34.12 SV32.1 SV32.2 SV32.3 SV32.4 SV32.5 SV32.6 SV32.7 SV32.8 SV32.9 SV32.10 SV32.11 SV32.12 116.71,194.31 | 167.51,129.54 SV52.1 SV52.2 SV52.3 SV52.4 SV52.5 SV52.6 SV52.7 SV52.8 SV52.9 SV52.10 SV52.11 SV52.12 SV50.1 SV50.2 SV50.3 SV50.4 SV50.5 SV50.6 SV50.7 SV50.8 SV50.9 SV50.10 SV50.11 SV50.12 167.51,194.31 | 192.91,129.54 SV56.1 SV56.2 SV56.3 SV56.4 SV56.5 SV56.6 SV56.7 SV56.8 SV56.9 SV56.10 SV56.11 SV56.12 SV54.1 SV54.2 SV54.3 SV54.4 SV54.5 SV54.6 SV54.7 SV54.8 SV54.9 SV54.10 SV54.11 SV54.12 192.91,194.31 | 218.31,129.54 SV60.1 SV60.2 SV60.3 SV60.4 SV60.5 SV60.6 SV60.7 SV60.8 SV60.9 SV60.10 SV60.11 SV60.12 SV58.1 SV58.2 SV58.3 SV58.4 SV58.5 SV58.6 SV58.7 SV58.8 SV58.9 SV58.10 SV58.11 SV58.12 218.31,194.31
  Bottom 0.813: 192.91,194.31 218.31,194.31 | 167.51,194.31 192.91,194.31 | 142.11,194.31 167.51,194.31 | 116.71,194.31 91.31,194.31 | 142.11,194.31 116.71,194.31 | B1.-@1 237.36,194.31 218.31,194.31
  pour Bottom (isolate 0.813): 4.95,194.31 4.95,201.93 252.6,201.93 252.6,189.23 237.36,189.23 237.36,194.31
INHIBIT
  Bottom 0.406: D10.13 224.66,24.13 224.66,15.88 223.39,14.61 U$2.AP2
INITIALIZE
  Top 0.406: D11.14 86.23,19.68 86.23,13.97 U$2.CR1
INT_IN_PROG
  Bottom 0.406: D8.13 151.64,23.5 151.64,15.88 152.91,14.61 U$2.BP2
INT_STROBE
  Bottom 0.406: D8.4 180.21,23.5 180.21,15.88 181.48,14.61 U$2.BD2
MD_DIR_H  (via drill 0.81)
  Top 0.406: IC8.13 206.88,113.03 v227.84,113.03
  Bottom 0.406: v227.84,113.03 227.84,99.69 IC7.9 | IC8.2 IC8.13
MD_DIR_L
  Bottom 0.406: IC8.12 201.8,115.57 211.96,115.57 IC7.3
MEM00
  Bottom 0.406: IC2.15 178.31,53.98 178.31,70.48 IC4.15
MEM01  (via drill 0.81)
  Top 0.406: IC2.16 173.86,52.07 v165.61,52.07
  Bottom 0.406: v165.61,52.07 161.16,56.52 161.16,71.75 162.43,73.03 IC4.13
MEM02  (via drill 0.81)
  Top 0.406: IC2.17 172.59,58.42 169.42,58.42 168.15,59.69 v165.61,59.69
  Bottom 0.406: v165.61,59.69 163.7,61.59 163.7,74.93 IC4.12
MEM03  (via drill 0.81)
  Top 0.406: v172.59,78.74 IC4.11
  Bottom 0.406: IC2.18 172.59,60.96 v172.59,78.74
MEM04
  Bottom 0.406: IC1.11 213.23,50.8 213.23,76.2 IC3.19
MEM05
  Bottom 0.406: IC1.12 211.96,52.07 211.96,74.93 IC3.18
MEM06
  Bottom 0.406: IC1.13 210.69,53.34 210.69,73.66 IC3.17
MEM07
  Bottom 0.406: IC1.14 209.42,54.61 209.42,72.39 IC3.16
MEM08
  Bottom 0.406: IC1.15 208.15,55.88 IC3.15
MEM09  (via drill 0.81)
  Top 0.406: v199.26,69.22 194.82,73.66 IC3.13
  Bottom 0.406: IC1.16 199.26,57.15 v199.26,69.22
MEM10  (via drill 0.81)
  Top 0.406: v204.34,67.31 195.45,76.2 IC3.12
  Bottom 0.406: IC1.17 204.34,57.15 v204.34,67.31
MEM11  (via drill 0.81)
  Top 0.406: v200.53,74.3 196.09,78.74 IC3.11
  Bottom 0.406: IC1.18 200.53,60.96 v200.53,74.3
N$1
  Bottom 0.406: IC5.7 222.12,44.45 222.12,67.31 S1.16
N$18  (via drill 0.81)
  Top 0.406: IC5.9 228.47,43.18 v228.47,45.72
  Bottom 0.406: v228.47,45.72 228.47,56.52 227.2,57.78 227.2,64.77 225.93,66.04 225.93,69.22 224.03,71.12 S1.15
N$19
  Bottom 0.406: IC5.10 229.74,44.45 229.74,56.52 228.47,57.78 228.47,64.77 227.2,66.04 227.2,69.85 S1.14
N$20
  Bottom 0.406: IC5.11 234.19,48.9 234.19,85.09 230.38,88.9 220.85,88.9 220.85,78.74 S1.13
N$21  (via drill 0.81)
  Top 0.406: v219.58,49.53 229.11,49.53 230.38,48.26 IC5.12
  Bottom 0.406: v219.58,49.53 217.04,52.07 217.04,69.22 222.76,74.93 224.66,74.93 224.66,77.47 S1.12
N$22
  Top 0.406: IC5.13 232.28,52.07 232.28,65.41 224.66,73.03 224.66,80.01 S1.11
N$23
  Bottom 0.406: IC5.14 232.28,54.61 232.28,65.41 229.74,67.94 229.74,81.92 224.03,87.63 222.12,87.63 222.12,85.09 S1.10
N$24
  Bottom 0.406: S1.9 228.47,81.28 228.47,66.67 229.74,65.41 229.74,57.78 231.01,56.52 IC5.15
N$25
  Bottom 0.406: D1.A 260.86,113.67 260.86,183.51 B1.+@3 B1.+ B1.+@4 B1.+@1 B1.+@2
N$26
  Top 0.406: S1.5 R5.4 246.89,78.74 252.6,73.03 252.6,52.07 IC6.12
N$27  (via drill 0.81)
  Top 0.406: S1.6 R5.3 v251.33,76.2
  Bottom 0.406: IC6.11 251.33,50.8 v251.33,76.2
N$28
  Top 0.406: R5.5 S1.4
  Bottom 0.406: IC6.6 244.98,44.45 244.98,74.3 246.25,75.56 R5.5
N$29
  Top 0.406: IC6.5 250.06,49.53 250.06,69.85 R5.6 S1.3
N$30
  Top 0.406: IC6.3 247.52,52.07 247.52,69.85 R5.7 S1.2
N$31
  Top 0.406: S1.1 R5.8 IC6.1
N$32  (via drill 0.81)
  Top 0.406: v232.92,67.31 246.25,53.98 IC6.2 | S1.8 R5.1
  Bottom 0.406: v232.92,67.31 232.28,67.94 232.28,85.09 S1.8
N$33
  Top 0.406: R5.2 S1.7
  Bottom 0.406: IC6.4 247.52,49.53 247.52,82.55 R5.2
N$34
  Bottom 0.406: IC32.1 IC31.1 IC33.1 IC30.1
N$35
  Top 0.406: R4.2 IC2.6
N$36
  Top 0.406: Q1.2 255.78,99.06 257.68,97.16 257.68,95.25 R6.2
N$37
  Top 0.406: R3.2 IC2.7
N$38
  Top 0.406: R2.2 IC2.8
N$39
  Top 0.406: R1.2 IC2.9
N$40
  Bottom 0.406: IC32.2 IC31.2 IC33.2 IC30.2
N$41
  Bottom 0.406: IC32.3 IC31.3 IC33.3 IC30.3
N$42
  Bottom 0.406: IC32.4 IC31.4 IC33.4 IC30.4
N$43
  Bottom 0.406: IC32.5 IC31.5 IC33.5 IC30.5
N$44
  Bottom 0.406: IC32.6 IC31.6 IC33.6 IC30.6
N$45
  Bottom 0.406: IC32.7 IC31.7 IC33.7 IC30.7
N$46
  Top 0.406: D9.2 257.68,19.68 257.68,13.97 U$2.AB1
N$47
  Top 0.406: D9.1 260.86,19.68 260.86,13.97 U$2.AA1
N$48
  Top 0.406: D7.2 187.83,19.68 187.83,13.97 U$2.BB1
N$49
  Top 0.406: D7.1 191.01,19.68 191.01,13.97 U$2.BA1
N$50
  Top 0.406: D11.1 127.51,19.68 127.51,13.97 U$2.CA1
N$51
  Bottom 0.406: D8.15 145.29,23.5 145.29,15.88 146.56,14.61 U$2.BS2
N$52
  Top 0.406: D11.2 124.33,19.68 124.33,13.97 U$2.CB1
N$53
  Top 0.406: D13.1 57.66,19.68 57.66,13.97 U$2.DA1
N$54
  Top 0.406: D13.2 54.48,19.68 54.48,13.97 U$2.DB1
N$55
  Bottom 0.406: IC12.1 IC11.1 IC13.1 IC10.1
N$56
  Bottom 0.406: IC12.2 IC11.2 IC13.2 IC10.2
N$57
  Bottom 0.406: IC12.3 IC11.3 IC13.3 IC10.3
N$58
  Bottom 0.406: IC12.4 IC11.4 IC13.4 IC10.4
N$59
  Bottom 0.406: IC12.5 IC11.5 IC13.5 IC10.5
N$60
  Bottom 0.406: IC12.6 IC11.6 IC13.6 IC10.6
N$61
  Bottom 0.406: IC12.7 IC11.7 IC13.7 IC10.7
N$62
  Bottom 0.406: IC12.8 IC11.8 IC13.8 IC10.8
N$63
  Bottom 0.406: IC12.9 IC11.9 IC13.9 IC10.9
N$64
  Bottom 0.406: IC12.10 IC11.10 IC13.10 IC10.10
N$65
  Bottom 0.406: IC12.11 IC11.11 IC13.11 IC10.11
N$66
  Bottom 0.406: IC12.12 IC11.12 IC13.12 IC10.12
N$67
  Bottom 0.406: IC10.13 IC11.13 IC13.13 IC12.13
N$68
  Bottom 0.406: IC10.14 IC11.14 IC13.14 IC12.14
N$69
  Bottom 0.406: IC10.15 IC11.15 IC13.15 IC12.15
N$70
  Bottom 0.406: IC10.16 IC11.16 IC13.16 IC12.16
N$71
  Bottom 0.406: IC10.17 IC11.17 IC13.17 IC12.17
N$72
  Bottom 0.406: IC10.18 IC11.18 IC13.18 IC12.18
N$73
  Bottom 0.406: IC10.19 IC11.19 IC13.19 IC12.19
N$74
  Bottom 0.406: IC10.20 IC11.20 IC13.20 IC12.20
N$75
  Bottom 0.406: IC10.21 IC11.21 IC13.21 IC12.21
N$76
  Bottom 0.406: IC10.22 IC11.22 IC13.22 IC12.22
N$77
  Bottom 0.406: IC10.23 IC11.23 IC13.23 IC12.23
N$78
  Bottom 0.406: IC10.24 IC11.24 IC13.24 IC12.24
N$79
  Bottom 0.406: IC16.1 IC15.1 IC17.1 IC14.1
N$80
  Bottom 0.406: IC16.2 IC15.2 IC17.2 IC14.2
N$81
  Bottom 0.406: IC16.3 IC15.3 IC17.3 IC14.3
N$82
  Bottom 0.406: IC16.4 IC15.4 IC17.4 IC14.4
N$83
  Bottom 0.406: IC16.5 IC15.5 IC17.5 IC14.5
N$84
  Bottom 0.406: IC16.6 IC15.6 IC17.6 IC14.6
N$85
  Bottom 0.406: IC16.7 IC15.7 IC17.7 IC14.7
N$86
  Bottom 0.406: IC16.8 IC15.8 IC17.8 IC14.8
N$87
  Bottom 0.406: IC16.9 IC15.9 IC17.9 IC14.9
N$88
  Bottom 0.406: IC16.10 IC15.10 IC17.10 IC14.10
N$89
  Bottom 0.406: IC16.11 IC15.11 IC17.11 IC14.11
N$90
  Bottom 0.406: IC16.12 IC15.12 IC17.12 IC14.12
N$91
  Bottom 0.406: IC14.13 IC15.13 IC17.13 IC16.13
N$92
  Bottom 0.406: IC14.14 IC15.14 IC17.14 IC16.14
N$93
  Bottom 0.406: IC14.15 IC15.15 IC17.15 IC16.15
N$94
  Bottom 0.406: IC14.16 IC15.16 IC17.16 IC16.16
N$95
  Bottom 0.406: IC14.17 IC15.17 IC17.17 IC16.17
N$96
  Bottom 0.406: IC14.18 IC15.18 IC17.18 IC16.18
N$97
  Bottom 0.406: IC14.19 IC15.19 IC17.19 IC16.19
N$98
  Bottom 0.406: IC14.20 IC15.20 IC17.20 IC16.20
N$99
  Bottom 0.406: IC14.21 IC15.21 IC17.21 IC16.21
N$100
  Bottom 0.406: IC14.22 IC15.22 IC17.22 IC16.22
N$101
  Bottom 0.406: IC14.23 IC15.23 IC17.23 IC16.23
N$102
  Bottom 0.406: IC14.24 IC15.24 IC17.24 IC16.24
N$103
  Bottom 0.406: IC20.1 IC19.1 IC21.1 IC18.1
N$104
  Bottom 0.406: IC20.2 IC19.2 IC21.2 IC18.2
N$105
  Bottom 0.406: IC20.3 IC19.3 IC21.3 IC18.3
N$106
  Bottom 0.406: IC20.4 IC19.4 IC21.4 IC18.4
N$107
  Bottom 0.406: IC20.5 IC19.5 IC21.5 IC18.5
N$108
  Bottom 0.406: IC20.6 IC19.6 IC21.6 IC18.6
N$109
  Bottom 0.406: IC20.7 IC19.7 IC21.7 IC18.7
N$110
  Bottom 0.406: IC20.8 IC19.8 IC21.8 IC18.8
N$111
  Bottom 0.406: IC20.9 IC19.9 IC21.9 IC18.9
N$112
  Bottom 0.406: IC20.10 IC19.10 IC21.10 IC18.10
N$113
  Bottom 0.406: IC20.11 IC19.11 IC21.11 IC18.11
N$114
  Bottom 0.406: IC20.12 IC19.12 IC21.12 IC18.12
N$115
  Bottom 0.406: IC18.13 IC19.13 IC21.13 IC20.13
N$116
  Bottom 0.406: IC18.14 IC19.14 IC21.14 IC20.14
N$117
  Bottom 0.406: IC18.15 IC19.15 IC21.15 IC20.15
N$118
  Bottom 0.406: IC18.16 IC19.16 IC21.16 IC20.16
N$119
  Bottom 0.406: IC18.17 IC19.17 IC21.17 IC20.17
N$120
  Bottom 0.406: IC18.18 IC19.18 IC21.18 IC20.18
N$121
  Bottom 0.406: IC18.19 IC19.19 IC21.19 IC20.19
N$122
  Bottom 0.406: IC18.20 IC19.20 IC21.20 IC20.20
N$123
  Bottom 0.406: IC18.21 IC19.21 IC21.21 IC20.21
N$124
  Bottom 0.406: IC18.22 IC19.22 IC21.22 IC20.22
N$125
  Bottom 0.406: IC18.23 IC19.23 IC21.23 IC20.23
N$126
  Bottom 0.406: IC18.24 IC19.24 IC21.24 IC20.24
N$127
  Bottom 0.406: IC24.1 IC23.1 IC25.1 IC22.1
N$128
  Bottom 0.406: IC24.2 IC23.2 IC25.2 IC22.2
N$129
  Bottom 0.406: IC24.3 IC23.3 IC25.3 IC22.3
N$130
  Bottom 0.406: IC24.4 IC23.4 IC25.4 IC22.4
N$131
  Bottom 0.406: IC24.5 IC23.5 IC25.5 IC22.5
N$132
  Bottom 0.406: IC24.6 IC23.6 IC25.6 IC22.6
N$133
  Bottom 0.406: IC24.7 IC23.7 IC25.7 IC22.7
N$134
  Bottom 0.406: IC24.8 IC23.8 IC25.8 IC22.8
N$135
  Bottom 0.406: IC24.9 IC23.9 IC25.9 IC22.9
N$136
  Bottom 0.406: IC24.10 IC23.10 IC25.10 IC22.10
N$137
  Bottom 0.406: IC24.11 IC23.11 IC25.11 IC22.11
N$138
  Bottom 0.406: IC24.12 IC23.12 IC25.12 IC22.12
N$139
  Bottom 0.406: IC22.13 IC23.13 IC25.13 IC24.13
N$140
  Bottom 0.406: IC22.14 IC23.14 IC25.14 IC24.14
N$141
  Bottom 0.406: IC22.15 IC23.15 IC25.15 IC24.15
N$142
  Bottom 0.406: IC22.16 IC23.16 IC25.16 IC24.16
N$143
  Bottom 0.406: IC22.17 IC23.17 IC25.17 IC24.17
N$144
  Bottom 0.406: IC22.18 IC23.18 IC25.18 IC24.18
N$145
  Bottom 0.406: IC22.19 IC23.19 IC25.19 IC24.19
N$146
  Bottom 0.406: IC22.20 IC23.20 IC25.20 IC24.20
N$147
  Bottom 0.406: IC22.21 IC23.21 IC25.21 IC24.21
N$148
  Bottom 0.406: IC22.22 IC23.22 IC25.22 IC24.22
N$149
  Bottom 0.406: IC22.23 IC23.23 IC25.23 IC24.23
N$150
  Bottom 0.406: IC22.24 IC23.24 IC25.24 IC24.24
N$151
  Bottom 0.406: IC28.1 IC27.1 IC29.1 IC26.1
N$152
  Bottom 0.406: IC28.2 IC27.2 IC29.2 IC26.2
N$153
  Bottom 0.406: IC28.3 IC27.3 IC29.3 IC26.3
N$154
  Bottom 0.406: IC28.4 IC27.4 IC29.4 IC26.4
N$155
  Bottom 0.406: IC28.5 IC27.5 IC29.5 IC26.5
N$156
  Bottom 0.406: IC28.6 IC27.6 IC29.6 IC26.6
N$157
  Bottom 0.406: IC28.7 IC27.7 IC29.7 IC26.7
N$158
  Bottom 0.406: IC28.8 IC27.8 IC29.8 IC26.8
N$159
  Bottom 0.406: IC28.9 IC27.9 IC29.9 IC26.9
N$160
  Bottom 0.406: IC28.10 IC27.10 IC29.10 IC26.10
N$161
  Bottom 0.406: IC28.11 IC27.11 IC29.11 IC26.11
N$162
  Bottom 0.406: IC28.12 IC27.12 IC29.12 IC26.12
N$163
  Bottom 0.406: IC26.13 IC27.13 IC29.13 IC28.13
N$164
  Bottom 0.406: IC26.14 IC27.14 IC29.14 IC28.14
N$165
  Bottom 0.406: IC26.15 IC27.15 IC29.15 IC28.15
N$166
  Bottom 0.406: IC26.16 IC27.16 IC29.16 IC28.16
N$167
  Bottom 0.406: IC26.17 IC27.17 IC29.17 IC28.17
N$168
  Bottom 0.406: IC26.18 IC27.18 IC29.18 IC28.18
N$169
  Bottom 0.406: IC26.19 IC27.19 IC29.19 IC28.19
N$170
  Bottom 0.406: IC26.20 IC27.20 IC29.20 IC28.20
N$171
  Bottom 0.406: IC26.21 IC27.21 IC29.21 IC28.21
N$172
  Bottom 0.406: IC26.22 IC27.22 IC29.22 IC28.22
N$173
  Bottom 0.406: IC26.23 IC27.23 IC29.23 IC28.23
N$174
  Bottom 0.406: IC26.24 IC27.24 IC29.24 IC28.24
N$175
  Bottom 0.406: IC32.8 IC31.8 IC33.8 IC30.8
N$176
  Bottom 0.406: IC32.9 IC31.9 IC33.9 IC30.9
N$177
  Bottom 0.406: IC32.10 IC31.10 IC33.10 IC30.10
N$178
  Bottom 0.406: IC32.11 IC31.11 IC33.11 IC30.11
N$179
  Bottom 0.406: IC32.12 IC31.12 IC33.12 IC30.12
N$180
  Bottom 0.406: IC30.13 IC31.13 IC33.13 IC32.13
N$181
  Bottom 0.406: IC30.14 IC31.14 IC33.14 IC32.14
N$182
  Bottom 0.406: IC30.15 IC31.15 IC33.15 IC32.15
N$183
  Bottom 0.406: IC30.16 IC31.16 IC33.16 IC32.16
N$184
  Bottom 0.406: IC30.17 IC31.17 IC33.17 IC32.17
N$185
  Bottom 0.406: IC30.18 IC31.18 IC33.18 IC32.18
N$186
  Bottom 0.406: IC30.19 IC31.19 IC33.19 IC32.19
N$187
  Bottom 0.406: IC30.20 IC31.20 IC33.20 IC32.20
N$188
  Bottom 0.406: IC30.21 IC31.21 IC33.21 IC32.21
N$189
  Bottom 0.406: IC30.22 IC31.22 IC33.22 IC32.22
N$190
  Bottom 0.406: IC30.23 IC31.23 IC33.23 IC32.23
N$191
  Bottom 0.406: IC30.24 IC31.24 IC33.24 IC32.24
N$192
  Bottom 0.406: IC36.1 IC35.1 IC37.1 IC34.1
N$193
  Bottom 0.406: IC36.2 IC35.2 IC37.2 IC34.2
N$194
  Bottom 0.406: IC36.3 IC35.3 IC37.3 IC34.3
N$195
  Bottom 0.406: IC36.4 IC35.4 IC37.4 IC34.4
N$196
  Bottom 0.406: IC36.5 IC35.5 IC37.5 IC34.5
N$197
  Bottom 0.406: IC36.6 IC35.6 IC37.6 IC34.6
N$198
  Bottom 0.406: IC36.7 IC35.7 IC37.7 IC34.7
N$199
  Bottom 0.406: IC36.8 IC35.8 IC37.8 IC34.8
N$200
  Bottom 0.406: IC36.9 IC35.9 IC37.9 IC34.9
N$201
  Bottom 0.406: IC36.10 IC35.10 IC37.10 IC34.10
N$202
  Bottom 0.406: IC36.11 IC35.11 IC37.11 IC34.11
N$203
  Bottom 0.406: IC36.12 IC35.12 IC37.12 IC34.12
N$204
  Bottom 0.406: IC34.13 IC35.13 IC37.13 IC36.13
N$205
  Bottom 0.406: IC34.14 IC35.14 IC37.14 IC36.14
N$206
  Bottom 0.406: IC34.15 IC35.15 IC37.15 IC36.15
N$207
  Bottom 0.406: IC34.16 IC35.16 IC37.16 IC36.16
N$208
  Bottom 0.406: IC34.17 IC35.17 IC37.17 IC36.17
N$209
  Bottom 0.406: IC34.18 IC35.18 IC37.18 IC36.18
N$210